# EAGLE design aqc-rev1 (EAGLE 6.1)

## Sheet 1 of 6
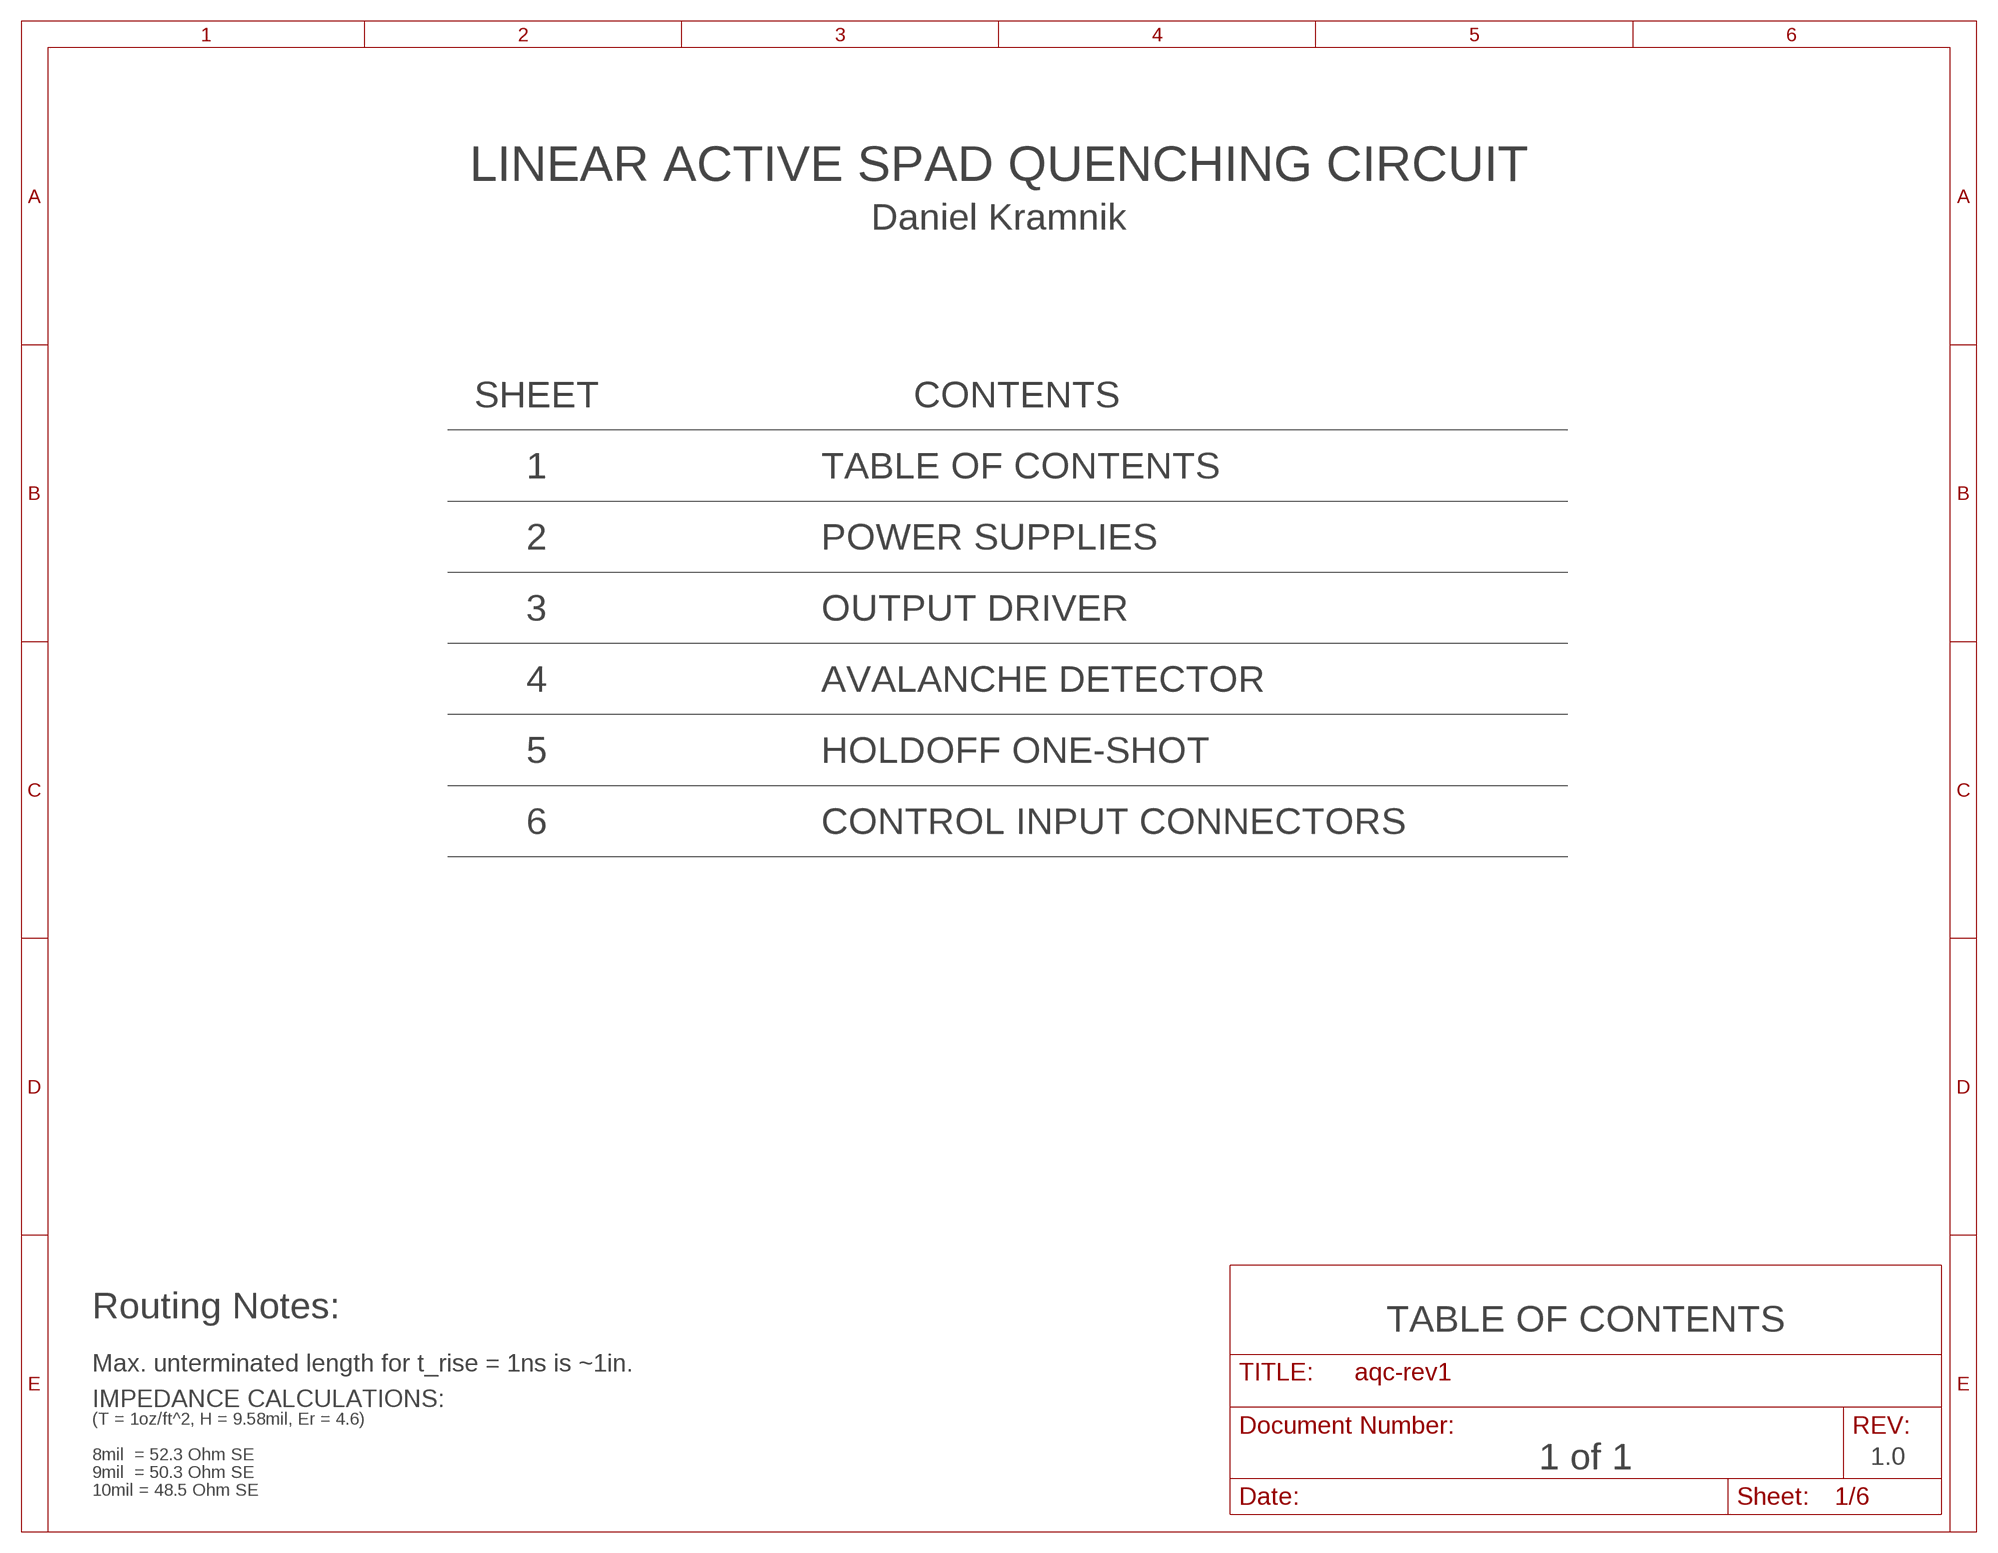
[diagram p0: schematic, sheet 1]

### Notes on the sheet
- LINEAR ACTIVE SPAD QUENCHING CIRCUIT
- Daniel Kramnik
- SHEET | CONTENTS
- 1 | TABLE OF CONTENTS
- 2 | POWER SUPPLIES
- 3 | OUTPUT DRIVER
- 4 | AVALANCHE DETECTOR
- 5 | HOLDOFF ONE-SHOT
- 6 | CONTROL INPUT CONNECTORS
- Routing Notes: | TABLE OF CONTENTS
- Max. unterminated length for t_rise = 1ns is ~1in.
- IMPEDANCE CALCULATIONS:
- (T = 1oz/ft^2, H = 9.58mil, Er = 4.6)
- 8mil  = 52.3 Ohm SE | 1 of 1 | 1.0
- 9mil  = 50.3 Ohm SE
- 10mil = 48.5 Ohm SE

## Sheet 2 of 6
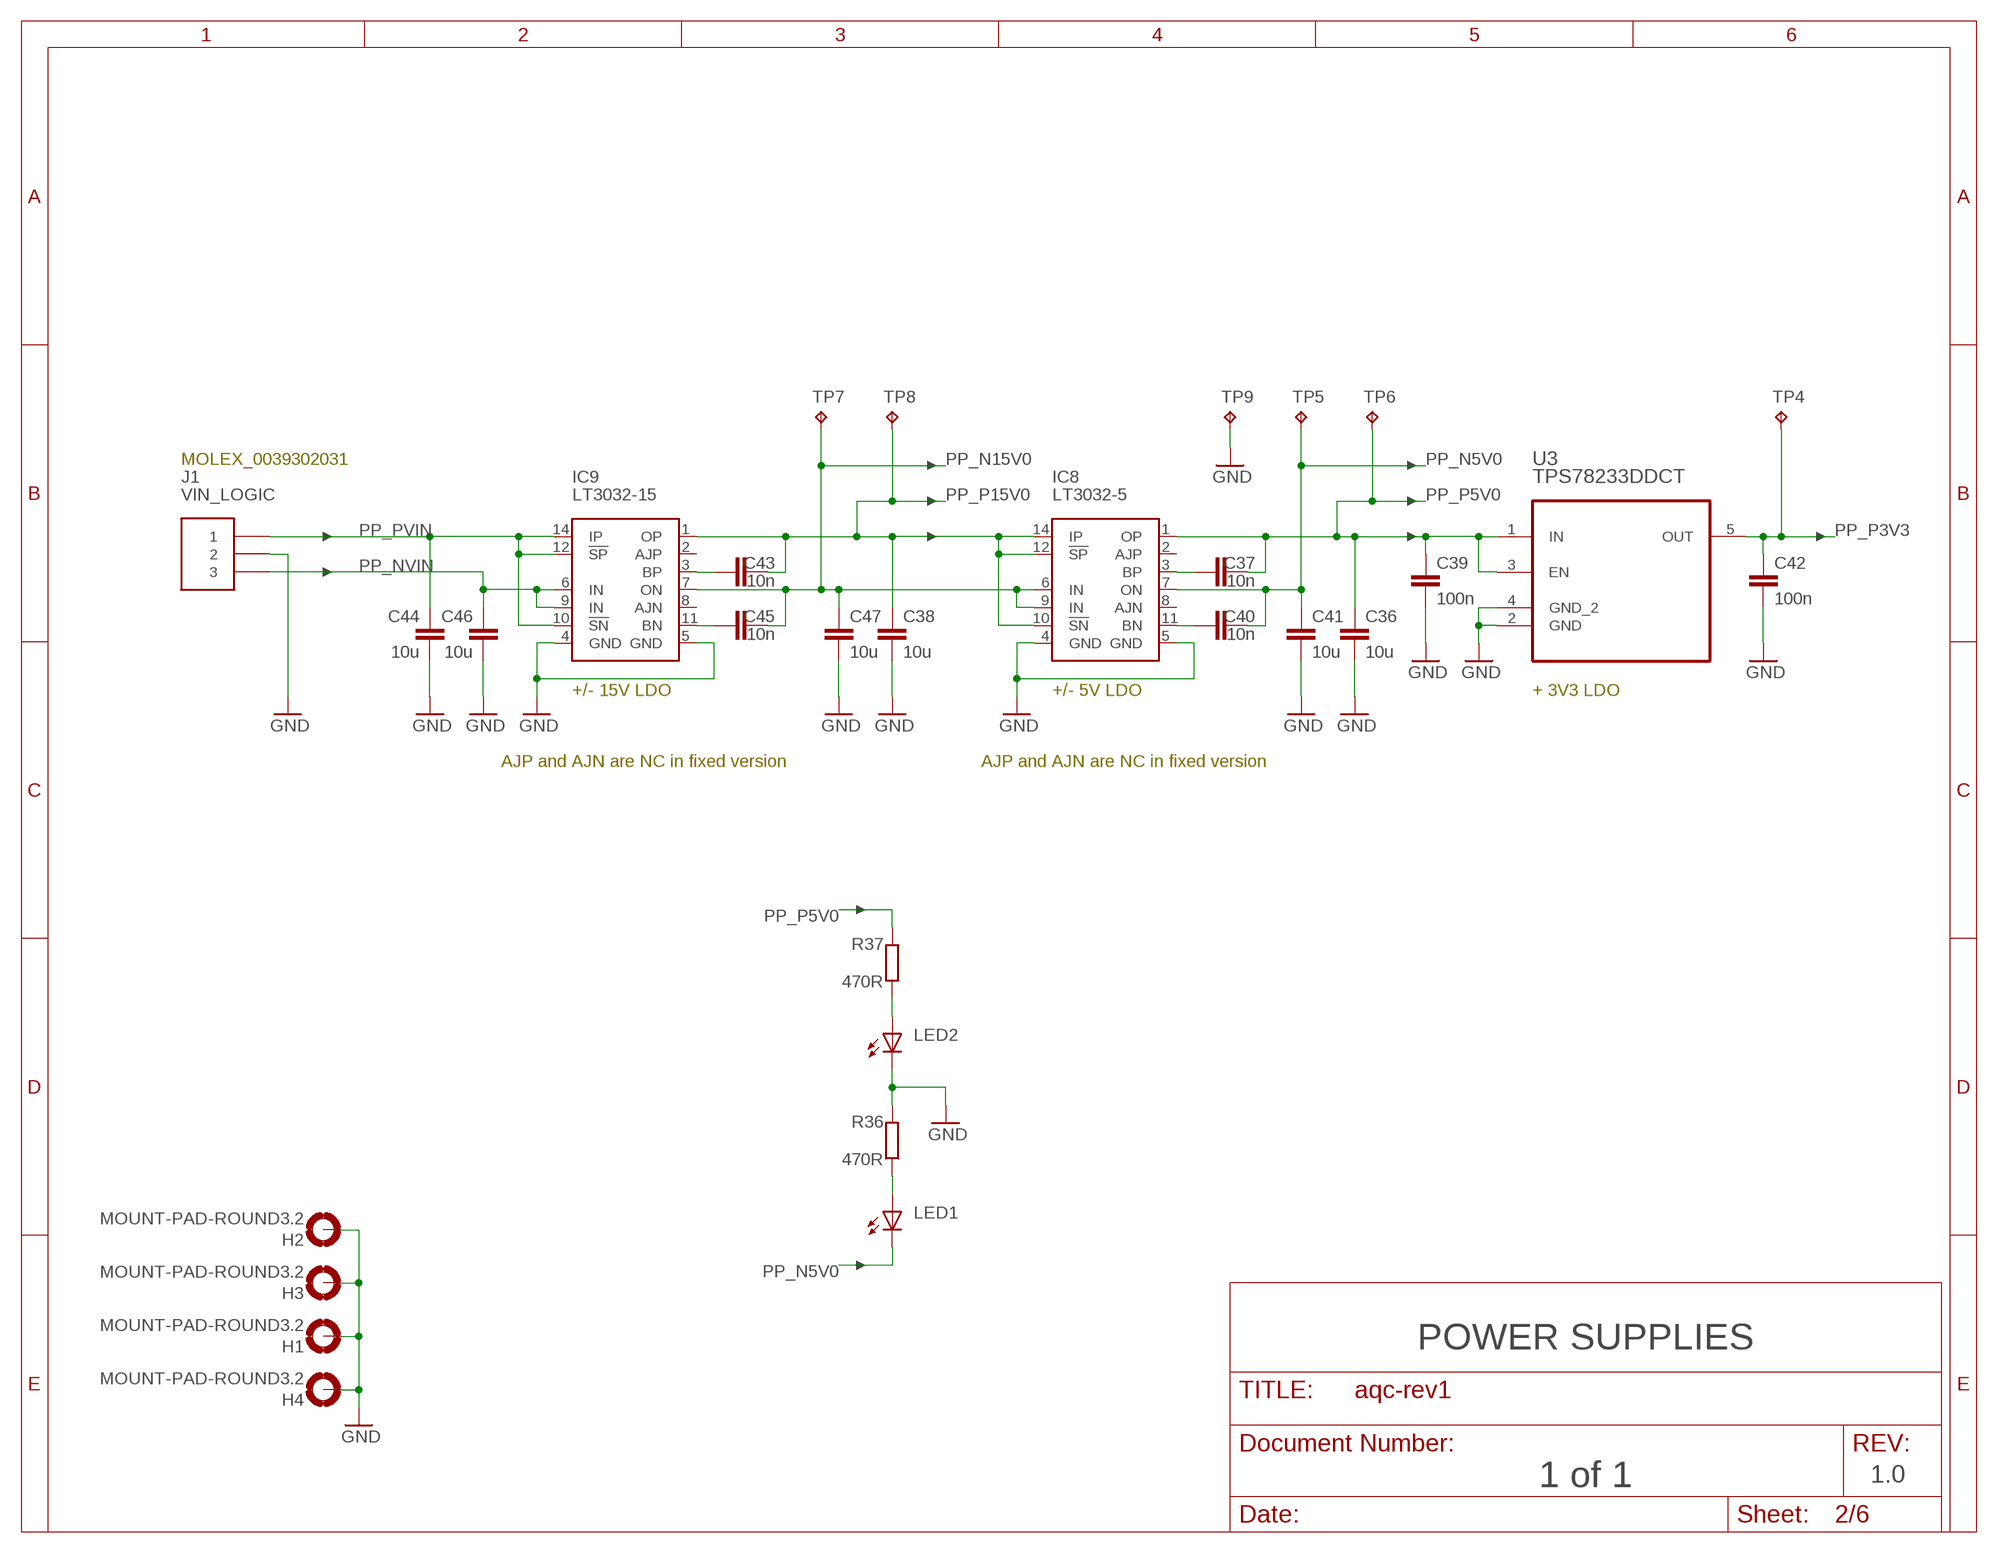
[diagram p1: schematic, sheet 2]

### Parts
C36  10u  C-EUC1206  [C1206]
C37  10n  C-EUC0603  [C0603]
C38  10u  C-EUC1206  [C1206]
C39  100n  C-EUC0603  [C0603]
C40  10n  C-EUC0603  [C0603]
C41  10u  C-EUC1206  [C1206]
C42  100n  C-EUC0603  [C0603]
C43  10n  C-EUC0603  [C0603]
C44  10u  C-EUC1206  [C1206]
C45  10n  C-EUC0603  [C0603]
C46  10u  C-EUC1206  [C1206]
C47  10u  C-EUC1206  [C1206]
H1  MOUNT-PAD-ROUND3.2  [3,2-PAD]
H2  MOUNT-PAD-ROUND3.2  [3,2-PAD]
H3  MOUNT-PAD-ROUND3.2  [3,2-PAD]
H4  MOUNT-PAD-ROUND3.2  [3,2-PAD]
IC8  LT3032-5  LT3032  [DFN14-4X3DE]
IC9  LT3032-15  LT3032  [DFN14-4X3DE]
J1  VIN_LOGIC  CONN_MOLEX_3PIN_MINI-FIT_JR  [CONN_MOLEX_3PIN_MINI-FIT_JR]
LED1  LEDCHIP-LED0805  [CHIP-LED0805]
LED2  LEDCHIP-LED0805  [CHIP-LED0805]
R36  470R  R-EU_R0805  [R0805]
R37  470R  R-EU_R0805  [R0805]
TP4  TPTP20R  [TP20R]
TP5  TPTP20R  [TP20R]
TP6  TPTP20R  [TP20R]
TP7  TPTP20R  [TP20R]
TP8  TPTP20R  [TP20R]
TP9  TPTP20R  [TP20R]
U3  TPS78233DDCT  [SOT95P280X110-5N]

### Nets
GND: C36.2 C38.2 C39.2 C41.2 C42.2 C44.2 C46.2 C47.2 H1.B3,2(MOUNT) H2.B3,2(MOUNT) H3.B3,2(MOUNT) H4.B3,2(MOUNT) IC8.4(GND) IC8.5(GND) IC9.4(GND) IC9.5(GND) J1.2 LED2.C R36.2 TP9.TP U3.2(GND) U3.4(GND_2) ; also sheet 3,4,5,6
N$8: C37.1 IC8.3(BP)
N$9: C40.1 IC8.11(BN)
N$33: C43.1 IC9.3(BP)
N$34: C45.1 IC9.11(BN)
N$39: LED1.A R36.1
N$40: LED2.A R37.1
PP_N5V0: C40.2 C41.1 IC8.7(ON) LED1.C TP5.TP ; also sheet 3,4,6
PP_N15V0: C45.2 C47.1 IC8.6(IN) IC8.9(IN) IC9.7(ON) TP7.TP
PP_NVIN: C46.1 IC9.6(IN) IC9.9(IN) J1.3
PP_P3V3: C42.1 TP4.TP U3.5(OUT) ; also sheet 4,5,6
PP_P5V0: C36.1 C37.2 C39.1 IC8.1(OP) R37.2 TP6.TP U3.1(IN) U3.3(EN) ; also sheet 3,4,6
PP_P15V0: C38.1 C43.2 IC8.10(!SN) IC8.12(!SP) IC8.14(IP) IC9.1(OP) TP8.TP ; also sheet 3
PP_PVIN: C44.1 IC9.10(!SN) IC9.12(!SP) IC9.14(IP) J1.1
Unconnected: IC8.2(AJP) IC8.8(AJN) IC9.2(AJP) IC9.8(AJN)

### Notes on the sheet
- MOLEX_0039302031
- +/- 15V LDO | +/- 5V LDO | + 3V3 LDO
- AJP and AJN are NC in fixed version | AJP and AJN are NC in fixed version
- POWER SUPPLIES
- 1 of 1 | 1.0

## Sheet 3 of 6
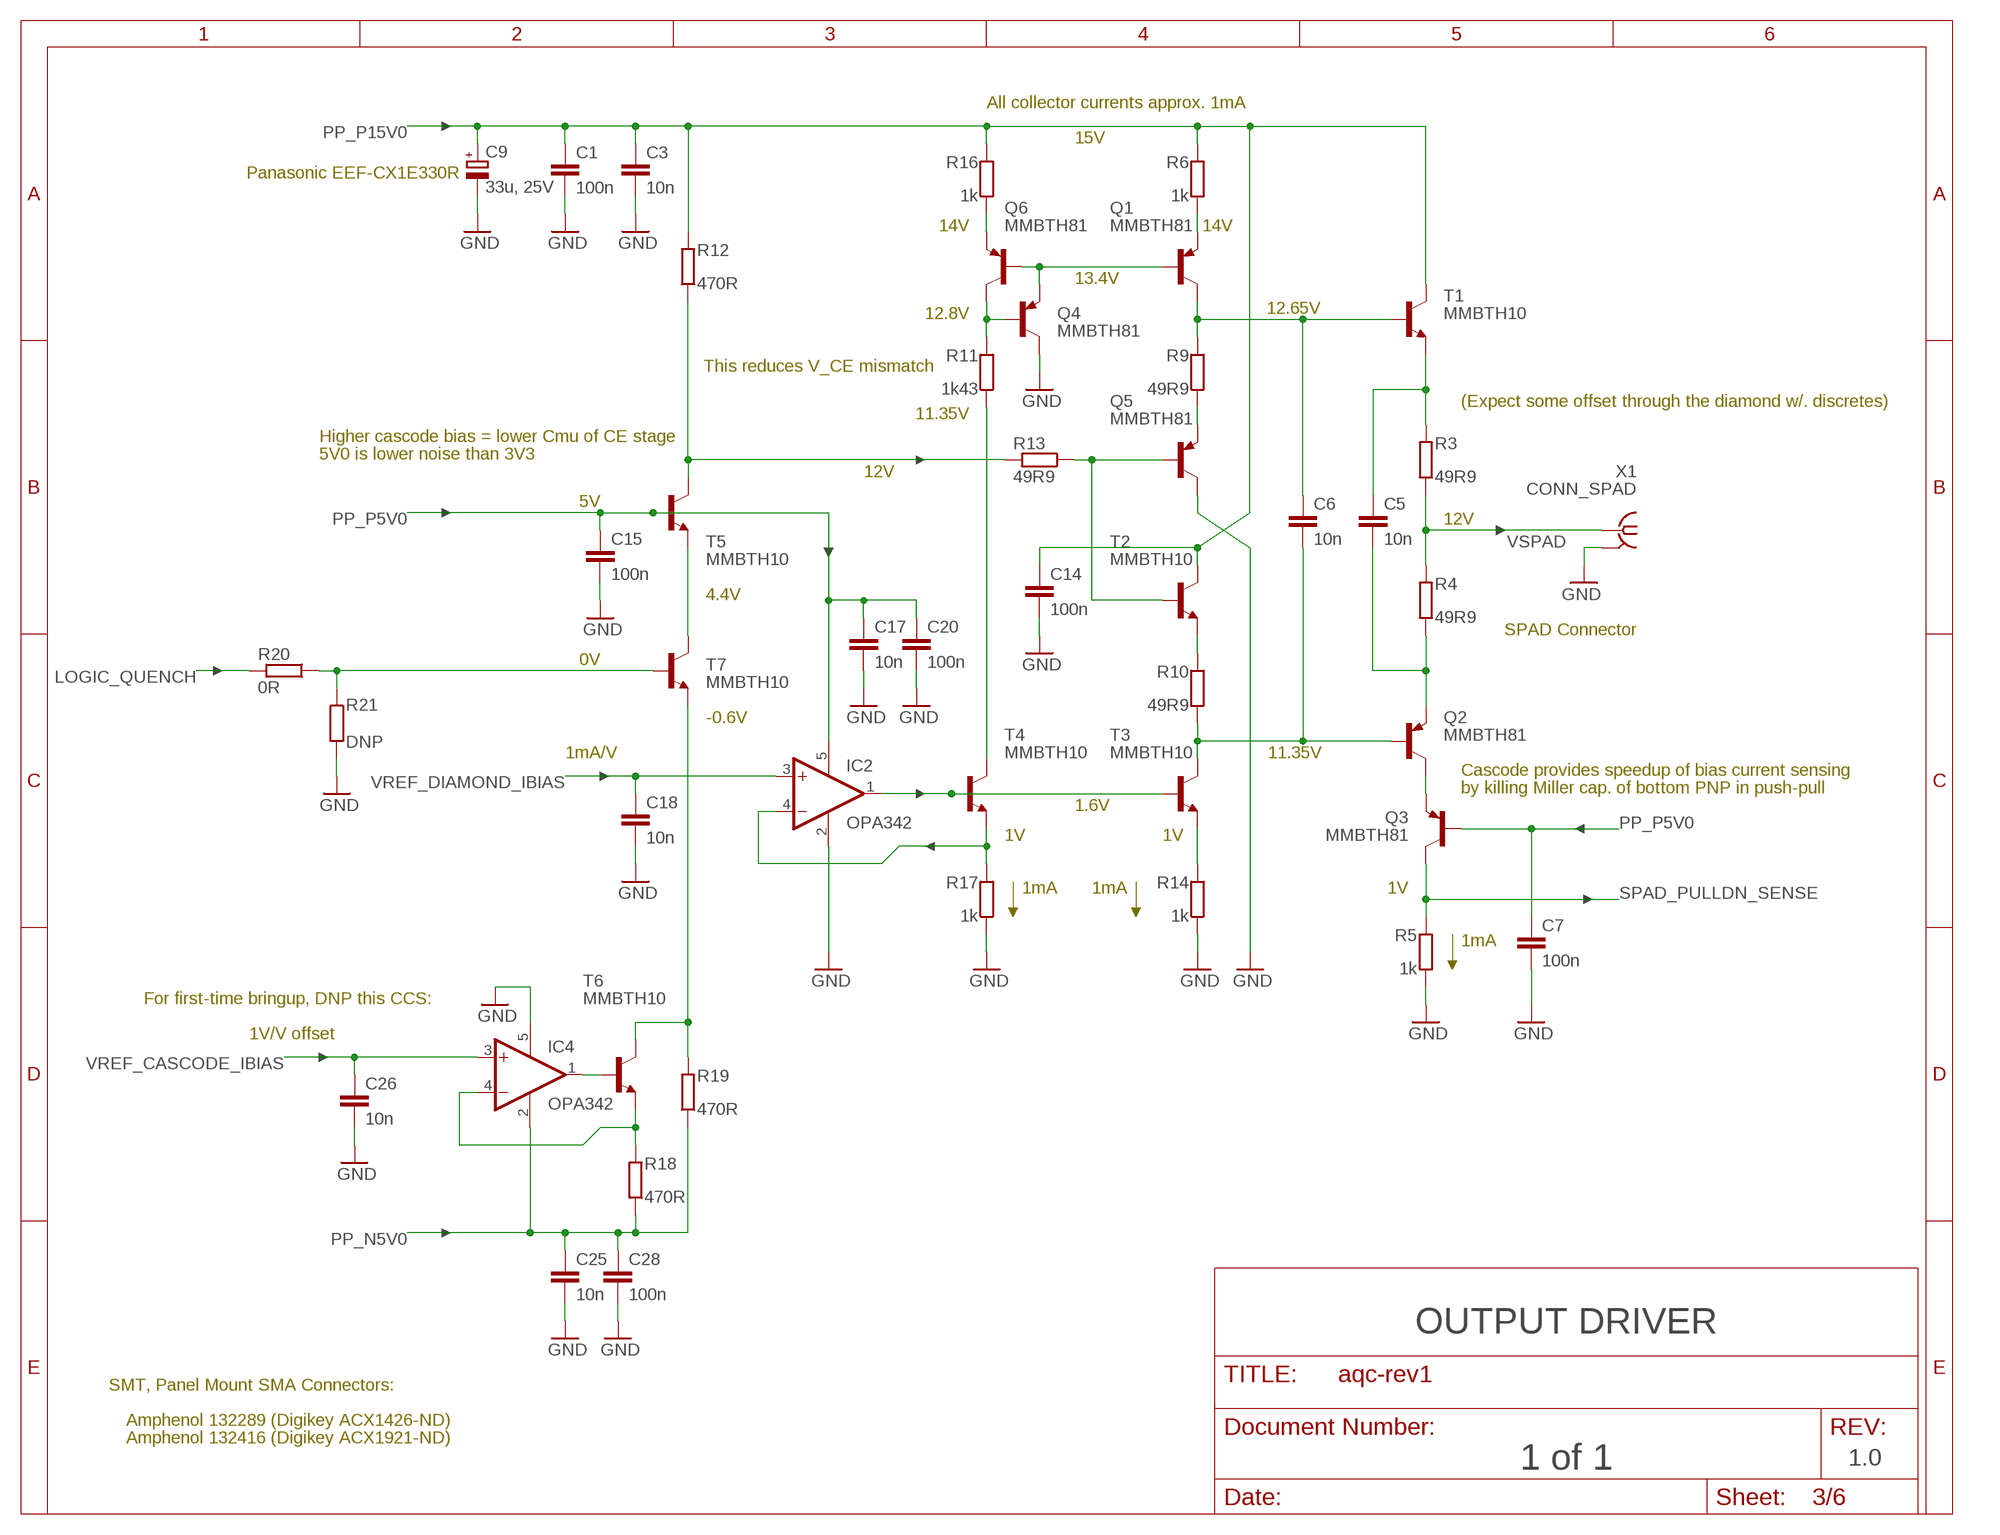
[diagram p2: schematic, sheet 3]

### Parts
C1  100n  C-EUC0603  [C0603]
C3  10n  C-EUC0603  [C0603]
C5  10n  C-EUC0603  [C0603]
C6  10n  C-EUC0603  [C0603]
C7  100n  C-EUC0603  [C0603]
C9  33u, 25V  CPOL-EUCT7343  [CT7343]
C14  100n  C-EUC0603  [C0603]
C15  100n  C-EUC0603  [C0603]
C17  10n  C-EUC0402  [C0402]
C18  10n  C-EUC0402  [C0402]
C20  100n  C-EUC0402  [C0402]
C25  10n  C-EUC0402  [C0402]
C26  10n  C-EUC0402  [C0402]
C28  100n  C-EUC0402  [C0402]
IC2  OPA342  OPA333DBV  [SOT23-5]
IC4  OPA342  OPA333DBV  [SOT23-5]
Q1  MMBTH81  MMBTH81LT1SMD  [SOT23-BEC]
Q2  MMBTH81  MMBTH81LT1SMD  [SOT23-BEC]
Q3  MMBTH81  MMBTH81LT1SMD  [SOT23-BEC]
Q4  MMBTH81  MMBTH81LT1SMD  [SOT23-BEC]
Q5  MMBTH81  MMBTH81LT1SMD  [SOT23-BEC]
Q6  MMBTH81  MMBTH81LT1SMD  [SOT23-BEC]
R3  49R9  R-EU_R0603  [R0603]
R4  49R9  R-EU_R0603  [R0603]
R5  1k  R-EU_R0603  [R0603]
R6  1k  R-EU_R0603  [R0603]
R9  49R9  R-EU_R0603  [R0603]
R10  49R9  R-EU_R0603  [R0603]
R11  1k43  R-EU_R0603  [R0603]
R12  470R  R-EU_R0603  [R0603]
R13  49R9  R-EU_R0603  [R0603]
R14  1k  R-EU_R0603  [R0603]
R16  1k  R-EU_R0603  [R0603]
R17  1k  R-EU_R0603  [R0603]
R18  470R  R-EU_R0603  [R0603]
R19  470R  R-EU_R0603  [R0603]
R20  0R  R-EU_R0603  [R0603]
R21  DNP  R-EU_R0603  [R0603]
T1  MMBTH10  MMBTH10LT1-NPN-SOT23-BEC  [SOT23-BEC]
T2  MMBTH10  MMBTH10LT1-NPN-SOT23-BEC  [SOT23-BEC]
T3  MMBTH10  MMBTH10LT1-NPN-SOT23-BEC  [SOT23-BEC]
T4  MMBTH10  MMBTH10LT1-NPN-SOT23-BEC  [SOT23-BEC]
T5  MMBTH10  MMBTH10LT1-NPN-SOT23-BEC  [SOT23-BEC]
T6  MMBTH10  MMBTH10LT1-NPN-SOT23-BEC  [SOT23-BEC]
T7  MMBTH10  MMBTH10LT1-NPN-SOT23-BEC  [SOT23-BEC]
X1  CONN_SPAD  SMA-142-0711-871/876  [J502-ND-142-0711-871/876]

### Nets
GND: C1.2 C3.2 C7.2 C9.- C14.2 C15.2 C17.2 C18.2 C20.2 C25.2 C26.2 C28.2 IC2.2(V-) IC4.5(V+) Q4.C Q5.C R5.1 R14.1 R17.1 R21.2 X1.G@1(GND) ; also sheet 2,4,5,6
LOGIC_QUENCH: R20.2 ; also sheet 5
LOGIC_QUENCH_ATTEN: R20.1 R21.1 T7.B
N$5: C5.1 R3.2 T1.E
N$10: Q2.C Q3.E
N$11: Q5.E R9.1
N$12: C6.1 Q1.C R9.2 T1.B
N$13: R10.2 T2.E
N$14: C5.2 Q2.E R4.1
N$15: T5.E T7.C
N$16: IC2.1(OUT) T3.B T4.B
N$18: Q4.B Q6.C R11.2
N$19: C6.2 Q2.B R10.1 T3.C
N$20: R14.2 T3.E
N$21: Q5.B R13.1 T2.B
N$22: R12.1 R13.2 T5.C
N$23: IC2.4(-IN) R17.2 T4.E
N$24: R19.2 T6.C T7.E
N$26: Q1.E R6.1
N$27: R11.1 T4.C
N$29: Q6.E R16.1
N$30: IC4.1(OUT) T6.B
N$31: Q1.B Q4.E Q6.B
N$35: IC4.4(-IN) R18.2 T6.E
PP_N5V0: C25.1 C28.1 IC4.2(V-) R18.1 R19.1 ; also sheet 2,4,6
PP_P5V0: C7.1 C15.1 C17.1 C20.1 IC2.5(V+) Q3.B T5.B ; also sheet 2,4,6
PP_P15V0: C1.1 C3.1 C9.+ C14.1 R6.2 R12.2 R16.2 T1.C T2.C ; also sheet 2
SPAD_PULLDN_SENSE: Q3.C R5.2 ; also sheet 4
VREF_CASCODE_IBIAS: C26.1 IC4.3(+IN) ; also sheet 6
VREF_DIAMOND_IBIAS: C18.1 IC2.3(+IN) ; also sheet 6
VSPAD: R3.1 R4.2 X1.1

### Notes on the sheet
- All collector currents approx. 1mA
- 15V
- Panasonic EEF-CX1E330R
- 14V | 14V
- 13.4V
- 12.65V
- 12.8V
- This reduces V_CE mismatch
- 11.35V | (Expect some offset through the diamond w/. discretes)
- Higher cascode bias = lower Cmu of CE stage
- 5V0 is lower noise than 3V3
- 12V
- 5V
- 12V
- 4.4V
- SPAD Connector
- 0V
- -0.6V
- 1mA/V | 11.35V
- Cascode provides speedup of bias current sensing
- by killing Miller cap. of bottom PNP in push-pull
- 1.6V
- 1V | 1V
- 1mA | 1mA | 1V
- 1mA
- For first-time bringup, DNP this CCS:
- 1V/V offset
- OUTPUT DRIVER
- SMT, Panel Mount SMA Connectors:
- Amphenol 132289 (Digikey ACX1426-ND)
- Amphenol 132416 (Digikey ACX1921-ND)
- 1 of 1 | 1.0

## Sheet 4 of 6
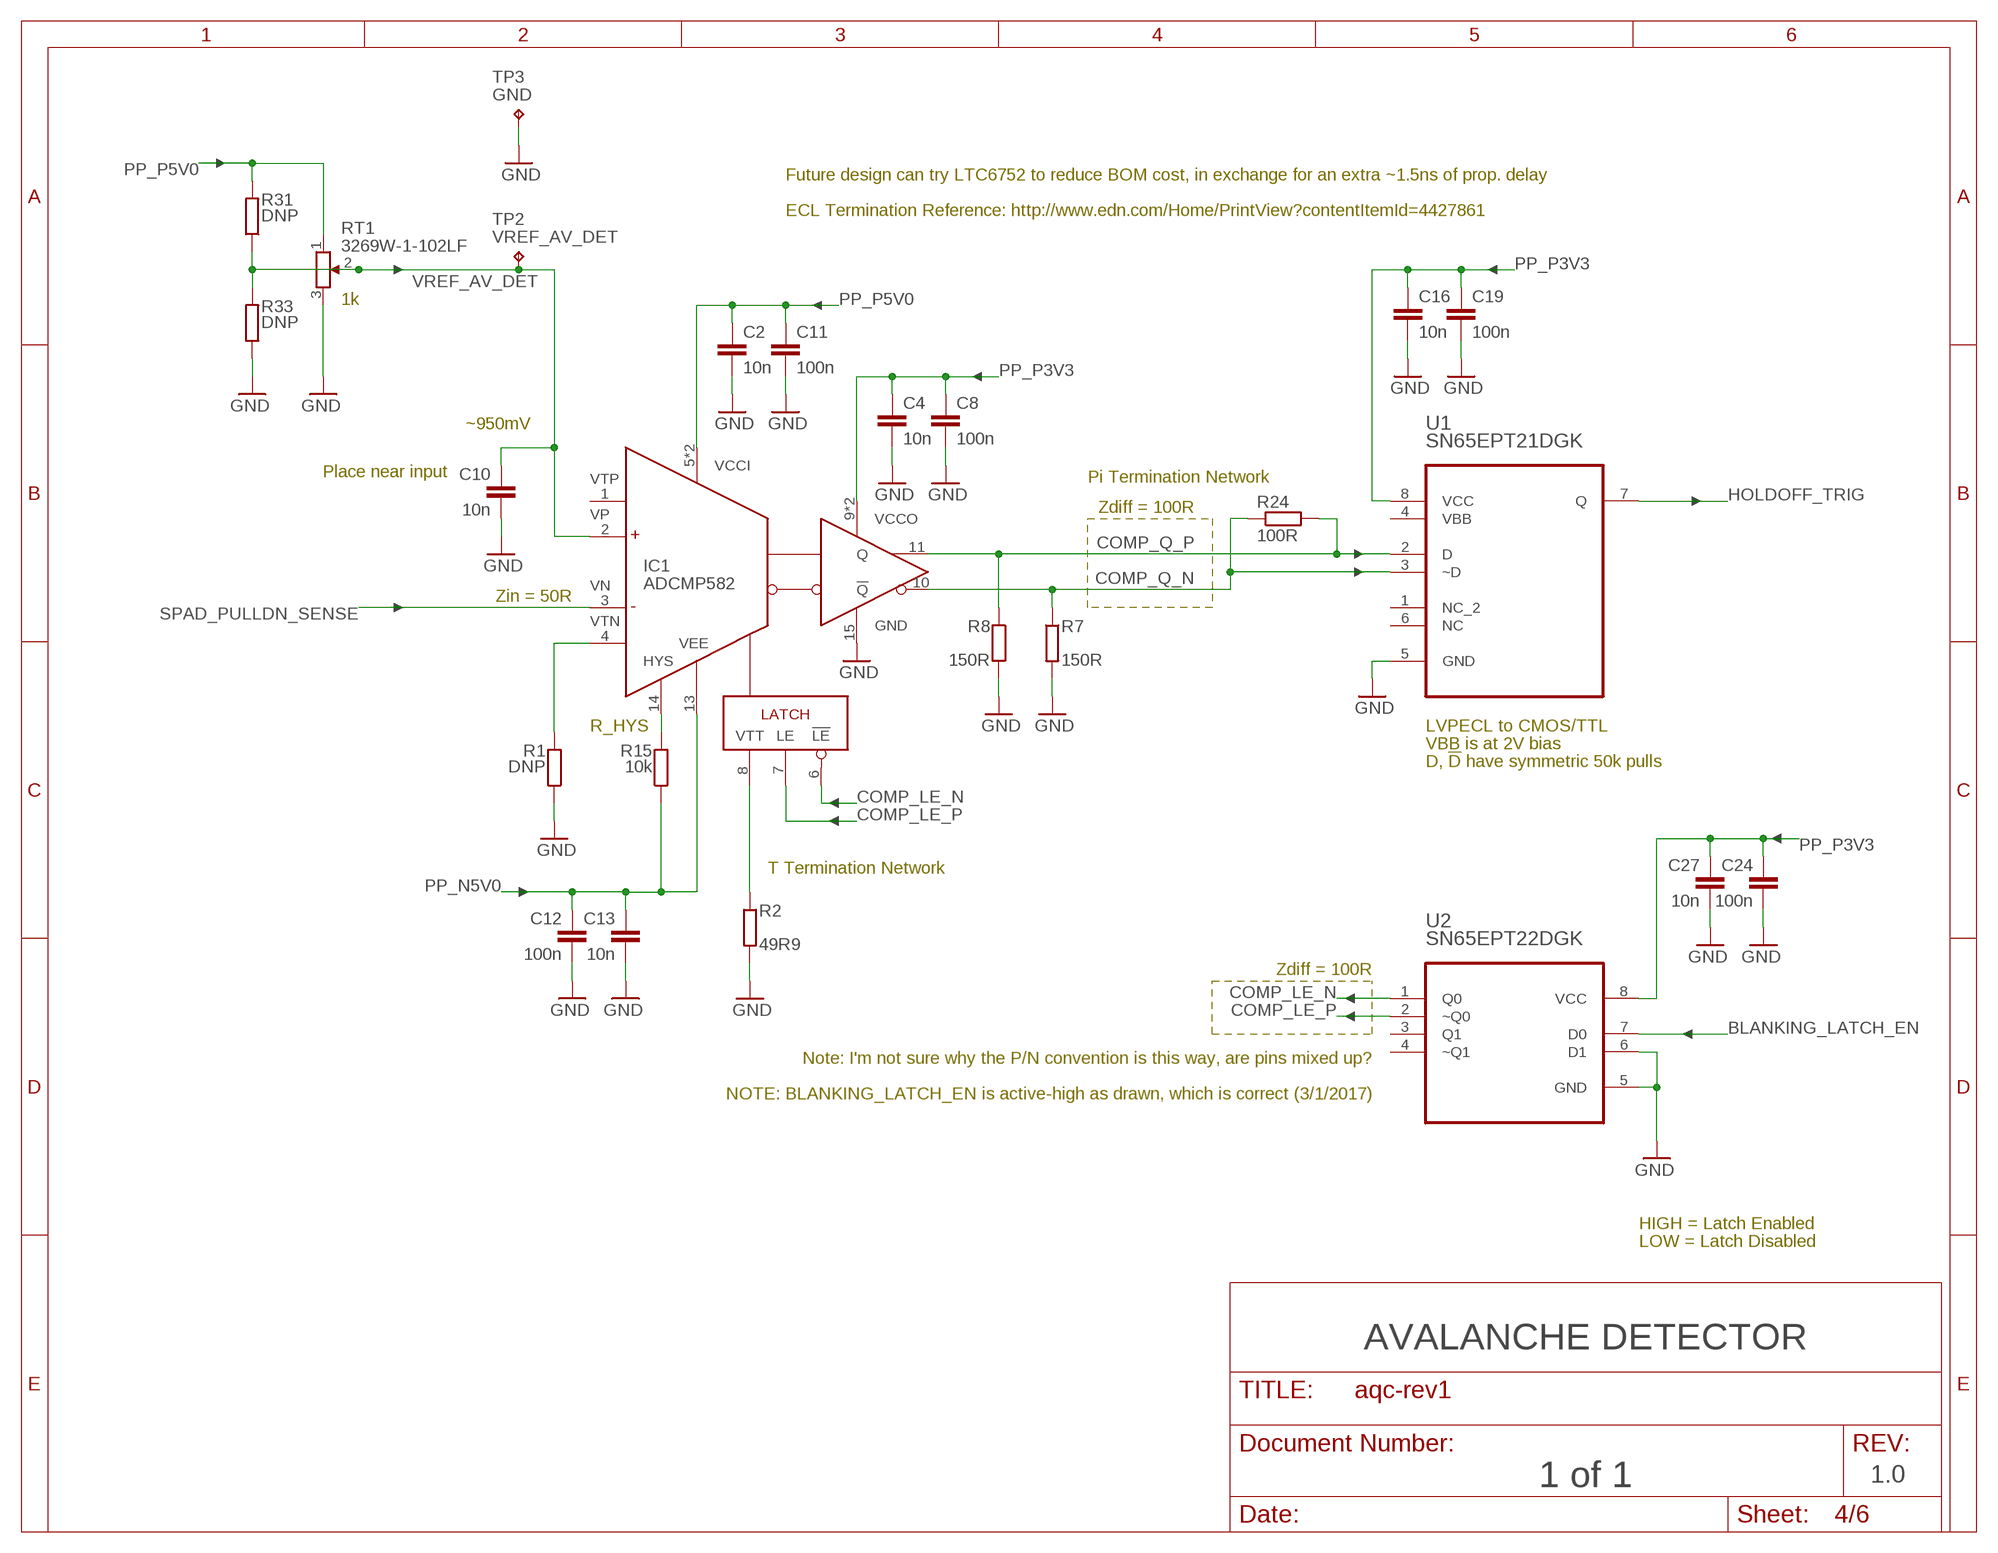
[diagram p3: schematic, sheet 4]

### Parts
C2  10n  C-EUC0402  [C0402]
C4  10n  C-EUC0402  [C0402]
C8  100n  C-EUC0402  [C0402]
C10  10n  C-EUC0603  [C0603]
C11  100n  C-EUC0402  [C0402]
C12  100n  C-EUC0402  [C0402]
C13  10n  C-EUC0402  [C0402]
C16  10n  C-EUC0402  [C0402]
C19  100n  C-EUC0402  [C0402]
C24  100n  C-EUC0402  [C0402]
C27  10n  C-EUC0402  [C0402]
IC1  ADCMP582  [QFN50P300X300X80-16N]
R1  DNP  R-EU_R0603  [R0603]
R2  49R9  R-EU_R0603  [R0603]
R7  150R  R-EU_R0402  [R0402]
R8  150R  R-EU_R0402  [R0402]
R15  10k  R-EU_R0603  [R0603]
R24  100R  R-EU_R0402  [R0402]
R31  DNP  R-EU_R0603  [R0603]
R33  DNP  R-EU_R0603  [R0603]
RT1  3269W-1-102LF  BOURNS_3269WX  [3269W]
TP2  VREF_AV_DET  KEYSTONE_5000  [KEYSTONE_5000_MINIATURE]
TP3  GND  KEYSTONE_5000  [KEYSTONE_5000_MINIATURE]
U1  SN65EPT21DGK  [SOP65P490X110-8N]
U2  SN65EPT22DGK  [SOP65P490X110-8N]

### Nets
BLANKING_LATCH_EN: U2.7(D0) ; also sheet 5
COMP_LE_N [100OHM_DIFF]: IC1.6(!LE) U2.1(Q0)
COMP_LE_P [100OHM_DIFF]: IC1.7(LE) U2.2(~Q0)
COMP_Q_N [100OHM_DIFF]: IC1.10(!Q) R7.1 R24.1 U1.3(~D)
COMP_Q_P [100OHM_DIFF]: IC1.11(Q) R8.1 R24.2 U1.2(D)
GND: C2.2 C4.2 C8.2 C10.2 C11.2 C12.2 C13.2 C16.2 C19.2 C24.2 C27.2 IC1.15(GND) R1.1 R2.2 R7.2 R8.2 R33.1 RT1.3 TP3.P$1 U1.5(GND) U2.5(GND) U2.6(D1) ; also sheet 2,3,5,6
HOLDOFF_TRIG: U1.7(Q) ; also sheet 5
N$3: IC1.4(VTN) R1.2
N$4: IC1.14(HYS) R15.2
N$6: IC1.8(VTT) R2.1
PP_N5V0: C12.1 C13.1 IC1.13(VEE) R15.1 ; also sheet 2,3,6
PP_P3V3: C4.1 C8.1 C16.1 C19.1 C24.1 C27.1 IC1.9(VCCO) IC1.12(VCCO) U1.8(VCC) U2.8(VCC) ; also sheet 2,5,6
PP_P5V0: C2.1 C11.1 IC1.5(VCCI) IC1.16(VCCI) R31.2 RT1.1 ; also sheet 2,3,6
SPAD_PULLDN_SENSE: IC1.3(VN) ; also sheet 3
VREF_AV_DET: C10.1 IC1.2(VP) R31.1 R33.2 RT1.2 TP2.P$1
Unconnected: IC1.1(VTP) U1.1(NC_2) U1.6(NC) U2.3(Q1) U2.4(~Q1)

### Notes on the sheet
- Future design can try LTC6752 to reduce BOM cost, in exchange for an extra ~1.5ns of prop. delay
- ECL Termination Reference: http://www.edn.com/Home/PrintView?contentItemId=4427861
- 1k
- ~950mV
- Place near input
- Pi Termination Network
- Zdiff = 100R
- Zin = 50R
- R_HYS | LVPECL to CMOS/TTL
- VBB is at 2V bias
- D, !D! have symmetric 50k pulls
- T Termination Network
- Zdiff = 100R
- Note: I'm not sure why the P/N convention is this way, are pins mixed up?
- NOTE: BLANKING_LATCH_EN is active-high as drawn, which is correct (3/1/2017)
- HIGH = Latch Enabled
- LOW = Latch Disabled
- AVALANCHE DETECTOR
- 1 of 1 | 1.0

## Sheet 5 of 6
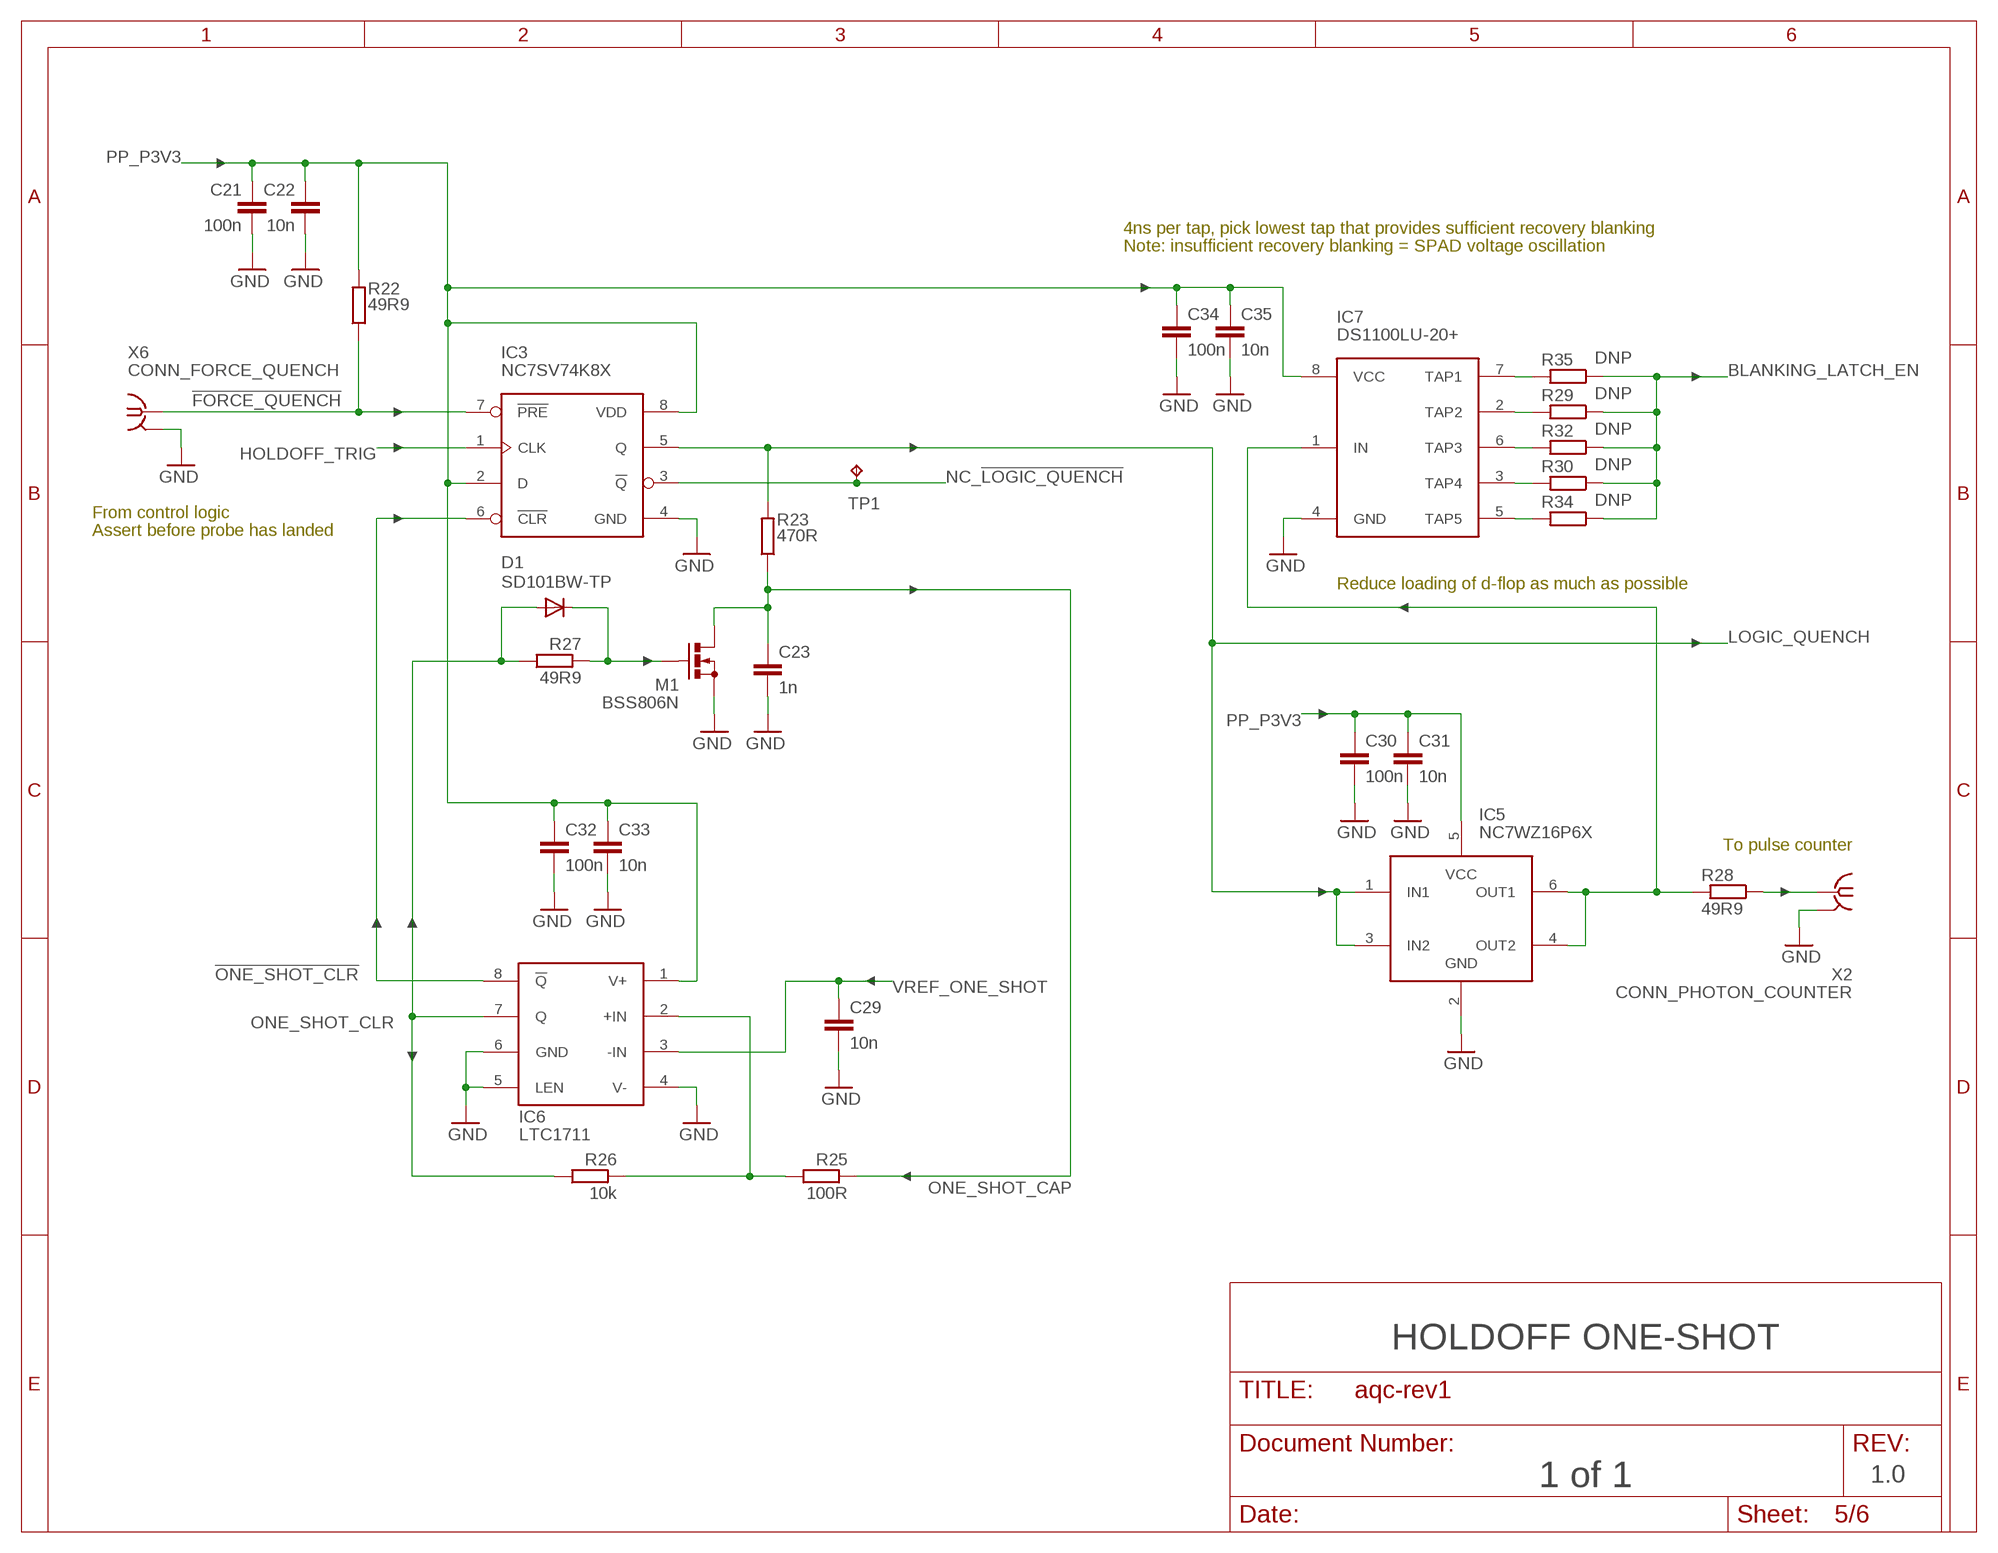
[diagram p4: schematic, sheet 5]

### Parts
C21  100n  C-EUC0402  [C0402]
C22  10n  C-EUC0402  [C0402]
C23  1n  C-EUC0603  [C0603]
C29  10n  C-EUC0402  [C0402]
C30  100n  C-EUC0402  [C0402]
C31  10n  C-EUC0402  [C0402]
C32  100n  C-EUC0402  [C0402]
C33  10n  C-EUC0402  [C0402]
C34  100n  C-EUC0402  [C0402]
C35  10n  C-EUC0402  [C0402]
D1  SD101BW-TP  DIODE-SOD123  [SOD123]
IC3  NC7SV74K8X  [US8_3.1MM_JDEC_MO-187]
IC5  NC7WZ16P6X  [SC70-6L]
IC6  LTC1711  [MSOP8]
IC7  DS1100LU-20+  DS1100L  [MSOP8]
M1  BSS806N  [SOT23R_INFINEON]
R22  49R9  R-EU_R0603  [R0603]
R23  470R  R-EU_R0603  [R0603]
R25  100R  R-EU_R0603  [R0603]
R26  10k  R-EU_R0603  [R0603]
R27  49R9  R-EU_R0603  [R0603]
R28  49R9  R-EU_R0603  [R0603]
R29  DNP  R-EU_R0603  [R0603]
R30  DNP  R-EU_R0603  [R0603]
R32  DNP  R-EU_R0603  [R0603]
R34  DNP  R-EU_R0603  [R0603]
R35  DNP  R-EU_R0603  [R0603]
TP1  TPTP08R  [TP08R]
X2  CONN_PHOTON_COUNTER  SMA-142-0711-871/876  [J502-ND-142-0711-871/876]
X6  CONN_FORCE_QUENCH  SMA-142-0711-871/876  [J502-ND-142-0711-871/876]

### Nets
!FORCE_QUENCH: IC3.7(!PRE) R22.1 X6.1
!ONE_SHOT_CLR: IC3.6(!CLR) IC6.8(!Q)
BLANKING_LATCH_EN: R29.1 R30.1 R32.1 R34.1 R35.1 ; also sheet 4
GND: C21.2 C22.2 C23.2 C29.2 C30.2 C31.2 C32.2 C33.2 C34.2 C35.2 IC3.4(GND) IC5.2(GND) IC6.4(V-) IC6.5(LEN) IC6.6(GND) IC7.4(GND) M1.2(S) X2.G@1(GND) X6.G@1(GND) ; also sheet 2,3,4,6
HOLDOFF_TRIG: IC3.1(CLK) ; also sheet 4
LOGIC_QUENCH: IC3.5(Q) IC5.1(IN1) IC5.3(IN2) R23.2 ; also sheet 3
N$2: R28.1 X2.1
N$25: IC6.2(+IN) R25.1 R26.2
N$36: D1.C M1.1(G) R27.2
N$37: IC5.4(OUT2) IC5.6(OUT1) IC7.1(IN) R28.2
NC_!LOGIC_QUENCH: IC3.3(!Q) TP1.TP
ONE_SHOT_CAP: C23.1 M1.3(D) R23.1 R25.2
ONE_SHOT_CLR: D1.A IC6.7(Q) R26.1 R27.1
PP_P3V3: C21.1 C22.1 C30.1 C31.1 C32.1 C33.1 C34.1 C35.1 IC3.2(D) IC3.8(VDD) IC5.5(VCC) IC6.1(V+) IC7.8(VCC) R22.2 ; also sheet 2,4,6
TAP1: IC7.7(TAP1) R35.2
TAP2: IC7.2(TAP2) R29.2
TAP3: IC7.6(TAP3) R32.2
TAP4: IC7.3(TAP4) R30.2
TAP5: IC7.5(TAP5) R34.2
VREF_ONE_SHOT: C29.1 IC6.3(-IN) ; also sheet 6

### Notes on the sheet
- 4ns per tap, pick lowest tap that provides sufficient recovery blanking
- Note: insufficient recovery blanking = SPAD voltage oscillation
- From control logic
- Assert before probe has landed
- Reduce loading of d-flop as much as possible
- To pulse counter
- HOLDOFF ONE-SHOT
- 1 of 1 | 1.0

## Sheet 6 of 6
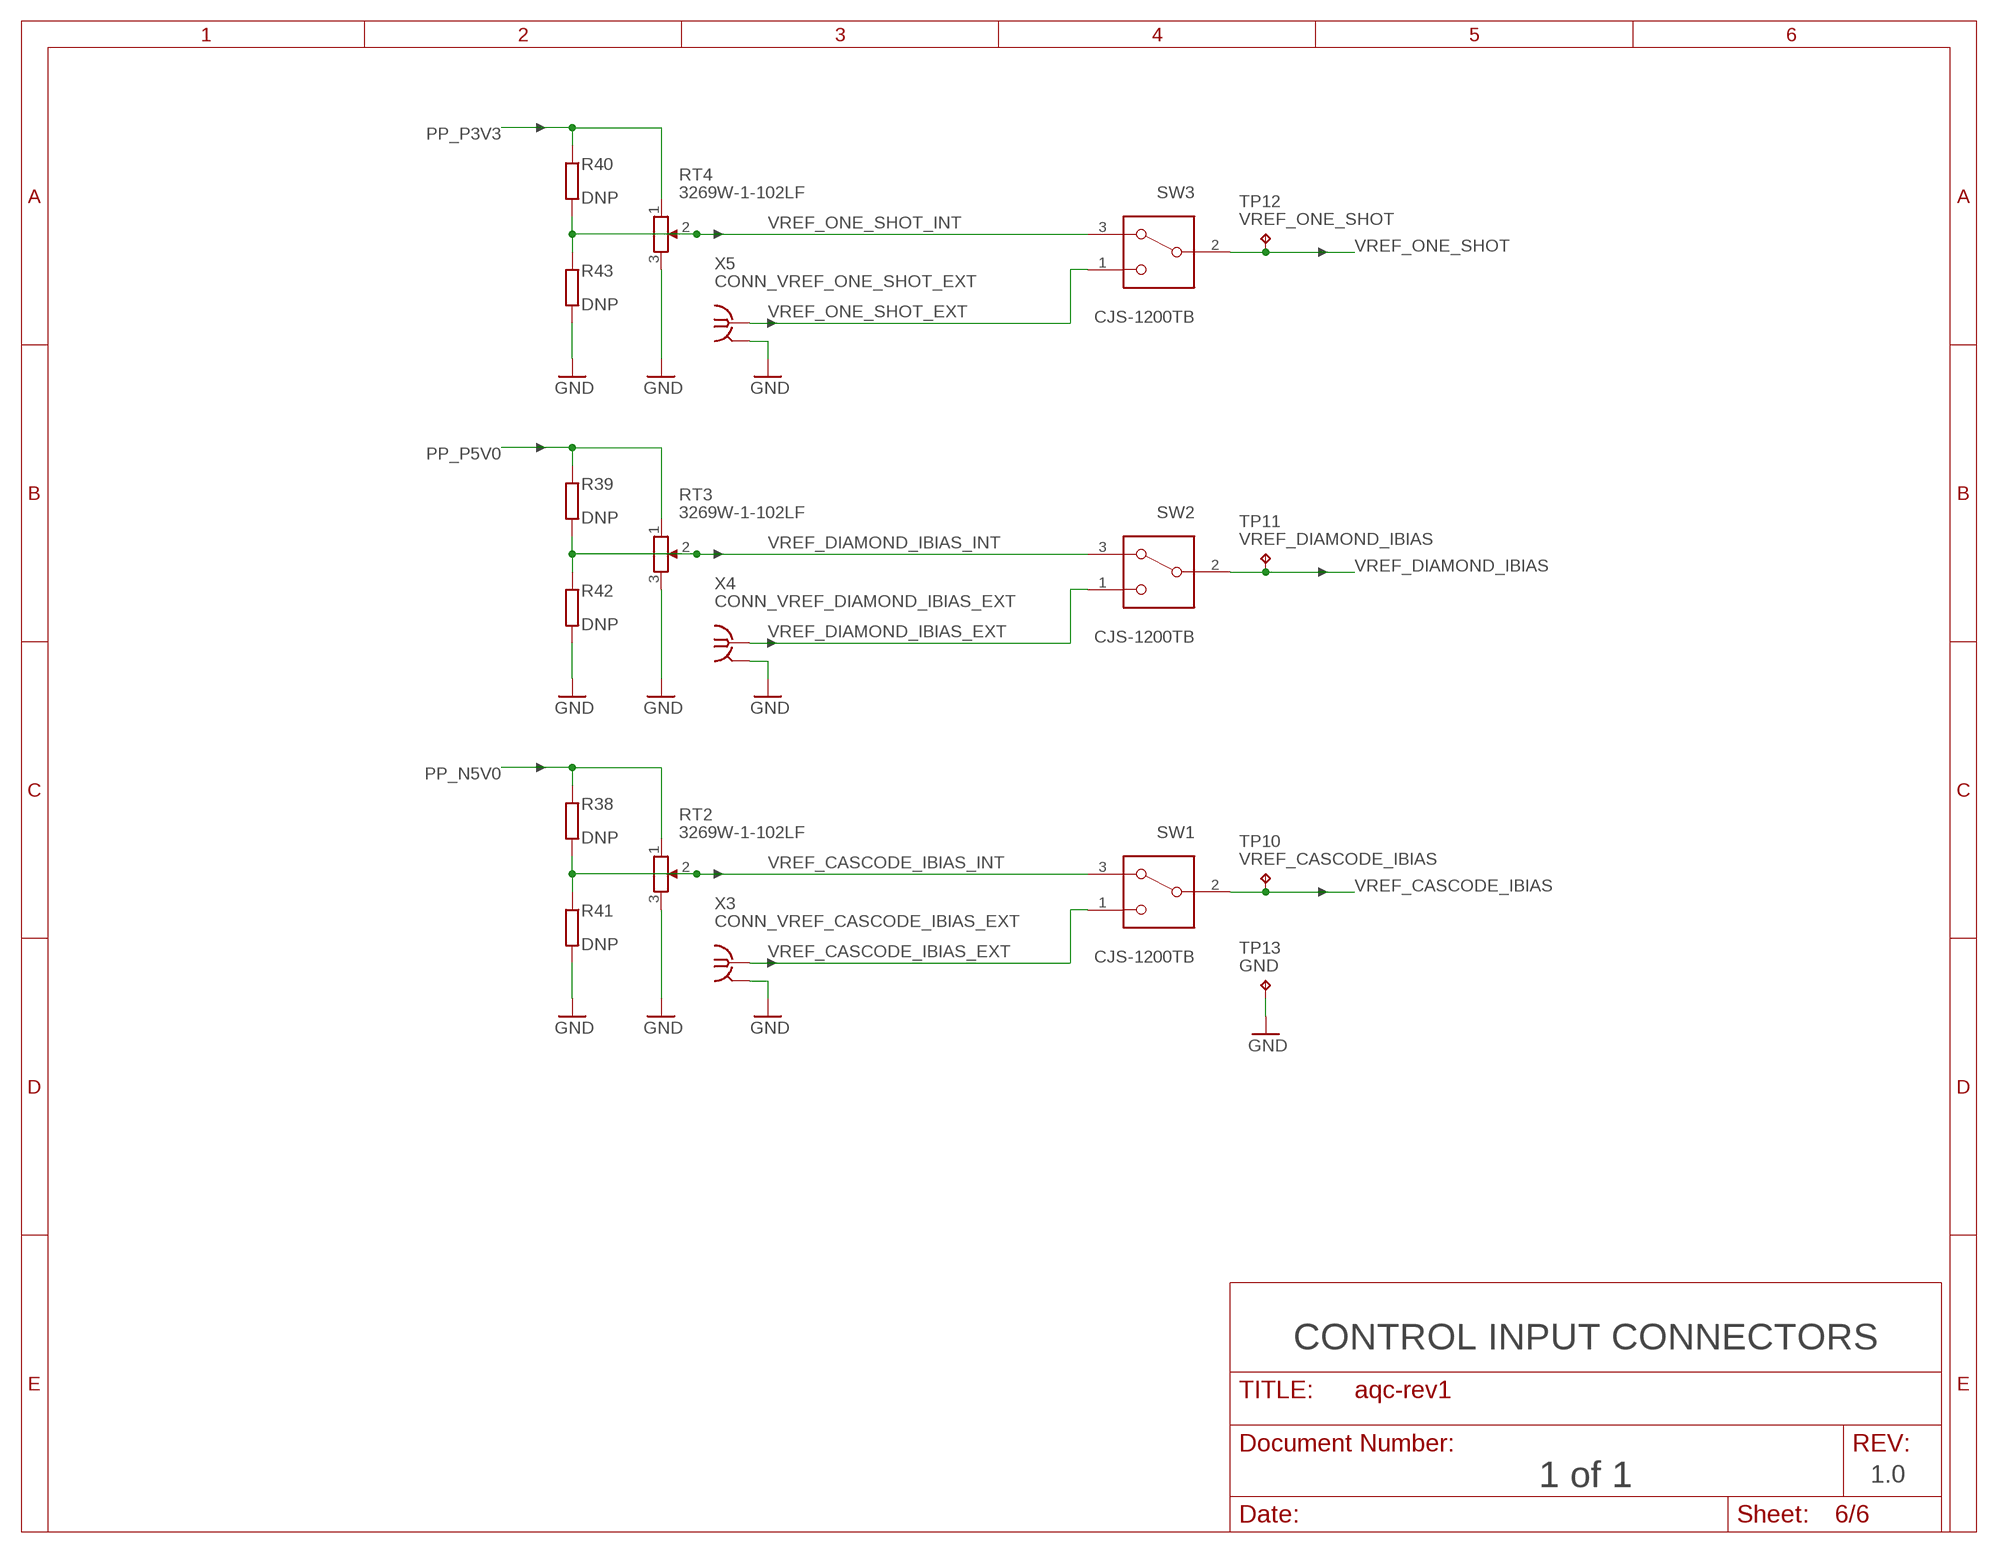
[diagram p5: schematic, sheet 6]

### Parts
R38  DNP  R-EU_R0603  [R0603]
R39  DNP  R-EU_R0603  [R0603]
R40  DNP  R-EU_R0603  [R0603]
R41  DNP  R-EU_R0603  [R0603]
R42  DNP  R-EU_R0603  [R0603]
R43  DNP  R-EU_R0603  [R0603]
RT2  3269W-1-102LF  BOURNS_3269WX  [3269W]
RT3  3269W-1-102LF  BOURNS_3269WX  [3269W]
RT4  3269W-1-102LF  BOURNS_3269WX  [3269W]
SW1  CJS-1200TB  [CJS-1200TB]
SW2  CJS-1200TB  [CJS-1200TB]
SW3  CJS-1200TB  [CJS-1200TB]
TP10  VREF_CASCODE_IBIAS  KEYSTONE_5000  [KEYSTONE_5000_MINIATURE]
TP11  VREF_DIAMOND_IBIAS  KEYSTONE_5000  [KEYSTONE_5000_MINIATURE]
TP12  VREF_ONE_SHOT  KEYSTONE_5000  [KEYSTONE_5000_MINIATURE]
TP13  GND  KEYSTONE_5000  [KEYSTONE_5000_MINIATURE]
X3  CONN_VREF_CASCODE_IBIAS_EXT  SMA-142-0711-871/876  [J502-ND-142-0711-871/876]
X4  CONN_VREF_DIAMOND_IBIAS_EXT  SMA-142-0711-871/876  [J502-ND-142-0711-871/876]
X5  CONN_VREF_ONE_SHOT_EXT  SMA-142-0711-871/876  [J502-ND-142-0711-871/876]

### Nets
GND: R41.2 R42.2 R43.2 RT2.3 RT3.3 RT4.3 TP13.P$1 X3.G@1(GND) X4.G@1(GND) X5.G@1(GND) ; also sheet 2,3,4,5
PP_N5V0: R38.1 RT2.1 ; also sheet 2,3,4
PP_P3V3: R40.1 RT4.1 ; also sheet 2,4,5
PP_P5V0: R39.1 RT3.1 ; also sheet 2,3,4
VREF_CASCODE_IBIAS: SW1.2(COM) TP10.P$1 ; also sheet 3
VREF_CASCODE_IBIAS_EXT: SW1.1(NO) X3.1
VREF_CASCODE_IBIAS_INT: R38.2 R41.1 RT2.2 SW1.3(NC)
VREF_DIAMOND_IBIAS: SW2.2(COM) TP11.P$1 ; also sheet 3
VREF_DIAMOND_IBIAS_EXT: SW2.1(NO) X4.1
VREF_DIAMOND_IBIAS_INT: R39.2 R42.1 RT3.2 SW2.3(NC)
VREF_ONE_SHOT: SW3.2(COM) TP12.P$1 ; also sheet 5
VREF_ONE_SHOT_EXT: SW3.1(NO) X5.1
VREF_ONE_SHOT_INT: R40.2 R43.1 RT4.2 SW3.3(NC)

### Notes on the sheet
- CONTROL INPUT CONNECTORS
- 1 of 1 | 1.0

## Power pins joined to a net without a drawn wire
GND: X1.G@2(GND) X1.G@3(GND) X1.G@4(GND) X2.G@2(GND) X2.G@3(GND) X2.G@4(GND) X3.G@2(GND) X3.G@3(GND) X3.G@4(GND) X4.G@2(GND) X4.G@3(GND) X4.G@4(GND) X5.G@2(GND) X5.G@3(GND) X5.G@4(GND) X6.G@2(GND) X6.G@3(GND) X6.G@4(GND)
VBB: U1.4(VBB)

## Library data of the parts
C1-C8 C10-C47 = rcl:C-EU: CAPACITOR, European symbol
C9 = rcl:CPOL-EU: POLARIZED CAPACITOR, European symbol
D1 = diode:DIODE-: DIODE
H1-H4 = holes:MOUNT-PAD-ROUND: MOUNTING PAD, round
IC1 = meng:ADCMP582: Ultrafast SiGe Voltage Comparator w/. PECL Outputs http://www.analog.com/media/en/technical-documentation/data-sheets/ADCMP580_581_582.pdf
IC2 IC4 = meng:OPA333: 1.8V, microPOWER CMOS OPERATIONAL AMPLIFIERS Zerø-Drift Series Source: Texas Instruments (Burr-Brown) .. U11 opa333 Operational Amp.pdf
IC3 = meng:NC7SV74K8X
IC5 = meng:NC7WZ16P6X
IC6 = meng:LTC1711
IC7 = meng:DS1100L
IC8 IC9 = meng:LT3032: LT3032 dual postive/negative LDO linear regulator; VALUE: LT3032
J1 = Kramnik's Library:CONN_MOLEX_3PIN_MINI-FIT_JR; VALUE: MOLEX_0039302031
LED1 LED2 = led:LED: LED OSRAM: - CHIPLED LG R971, LG N971, LY N971, LG Q971, LY Q971, LO R971, LY R971 LH N974, LH R974 LS Q976, LO Q976, LY Q976 LO Q996 - Hyper CHIPLED LW Q18S LB Q993, LB Q99A, LB R99A - SideLED LS A670, LO A670, LY A670, LG A670, LP A670 LB A673, LV A673, LT A673, LW A673 LH A674 LY A675 LS A676, LA A676, LO A676, LY A676, LW A676 LS A679, LY A679, LG A679 - Hyper Micro SIDELED® LS Y876, LA Y876, LO Y876, LY Y876 LT Y87S - SmartLED LW L88C, LW L88S LB L89C, LB L89S, LG L890 LS L89K, LO L89K, LY L89K LS L896, LA L896, LO L896, LY L896 - TOPLED LS T670, LO T670, LY T670, LG T670, LP T670 LSG T670, LSP T670, LSY T670, LOP T670, LYG T670 LG T671, LOG T671, LSG T671 LB T673, LV T673, LT T673, LW T673 LH T674 LS T676, LA T676, LO T676, LY T676, LB T676, LH T676, LSB T676, LW T676 LB T67C, LV T67C, LT T67C, LS T67K, LO T67K, LY T67K, LW E67C LS E67B, LA E67B, LO E67B, LY E67B, LB E67C, LV E67C, LT E67C LW T67C LS T679, LY T679, LG T679 LS T770, LO T770, LY T770, LG T770, LP T770 LB T773, LV T773, LT T773, LW T773 LH T774 LS E675, LA E675, LY E675, LS T675 LS T776, LA T776, LO T776, LY T776, LB T776 LHGB T686 LT T68C, LB T68C - Hyper Mini TOPLED® LB M676 - Mini TOPLED Santana® LG M470 LS M47K, LO M47K, LY M47K Source: http://www.osram.convergy.de LUXEON: - LUMILED® LXK2-PW12-R00, LXK2-PW12-S00, LXK2-PW14-U00, LXK2-PW14-V00 LXK2-PM12-R00, LXK2-PM12-S00, LXK2-PM14-U00 LXK2-PE12-Q00, LXK2-PE12-R00, LXK2-PE12-S00, LXK2-PE14-T00, LXK2-PE14-U00 LXK2-PB12-K00, LXK2-PB12-L00, LXK2-PB12-M00, LXK2-PB14-N00, LXK2-PB14-P00, LXK2-PB14-Q00 LXK2-PR12-L00, LXK2-PR12-M00, LXK2-PR14-Q00, LXK2-PR14-R00 LXK2-PD12-Q00, LXK2-PD12-R00, LXK2-PD12-S00 LXK2-PH12-R00, LXK2-PH12-S00 LXK2-PL12-P00, LXK2-PL12-Q00, LXK2-PL12-R00 Source: www.luxeon.com KINGBRIGHT: KA-3528ASYC Source: www.kingbright.com
M1 = meng:BSS806N
Q1-Q6 = transistor-pnp:MMBTH81*: PNP Transistror
R1-R35 R38-R43 = rcl:R-EU_: RESISTOR, European symbol
R36 R37 = resistor:R-EU_: RESISTOR, European symbol
RT1-RT4 = meng:BOURNS_3269WX
SW1-SW3 = meng:CJS-1200TB
T1-T7 = transistor:*-NPN-: NPN Transistror BF959 corrected 2008.03.06
TP1 TP4-TP9 = testpad:TP: Test pad
TP2 TP3 TP10-TP13 = Kramnik's Library:KEYSTONE_5000
U1 = Texas Instruments_By_element14_Batch_1:SN65EPT21DGK: 3.3-V Differential PECL/LVDS to TTL Translator; MPN: SN65EPT21DGK; OC_FARNELL: -; OC_NEWARK: 74R6512; PACKAGE: MSOP-8; SUPPLIER: Texas Instruments
U2 = Texas Instruments_By_element14_Batch_1:SN65EPT22DGK: Dual LVTTL/LVCMOS to Differential LVPECL Buffer; MPN: SN65EPT22DGK; OC_FARNELL: -; OC_NEWARK: 45P8158; PACKAGE: MSOP-8; SUPPLIER: Texas Instruments
U3 = Texas Instruments_By_element14_Batch_1 (2):TPS78233DDCT: Low-Dropout Linear Regulator; MPN: TPS78233DDCT; OC_FARNELL: 1710835; OC_NEWARK: 45P8307; PACKAGE: TSOT-23-5; SUPPLIER: Texas Instruments
X1-X6 = con-coax:SMA-: SMA 50 Ohm End Launch Jack Receptacle - Round Contact Johnson Components Source: www.johnsoncomponents.com .. J502-ND.pdf; MF: JOHNSON COMPONENTS; MPN: 142-0711-871; OC_FARNELL: unknown; OC_NEWARK: 01C1639

## Net classes
1 100OHM_DIFF: width 0.254 mm, clearance 0.254 mm

## Board
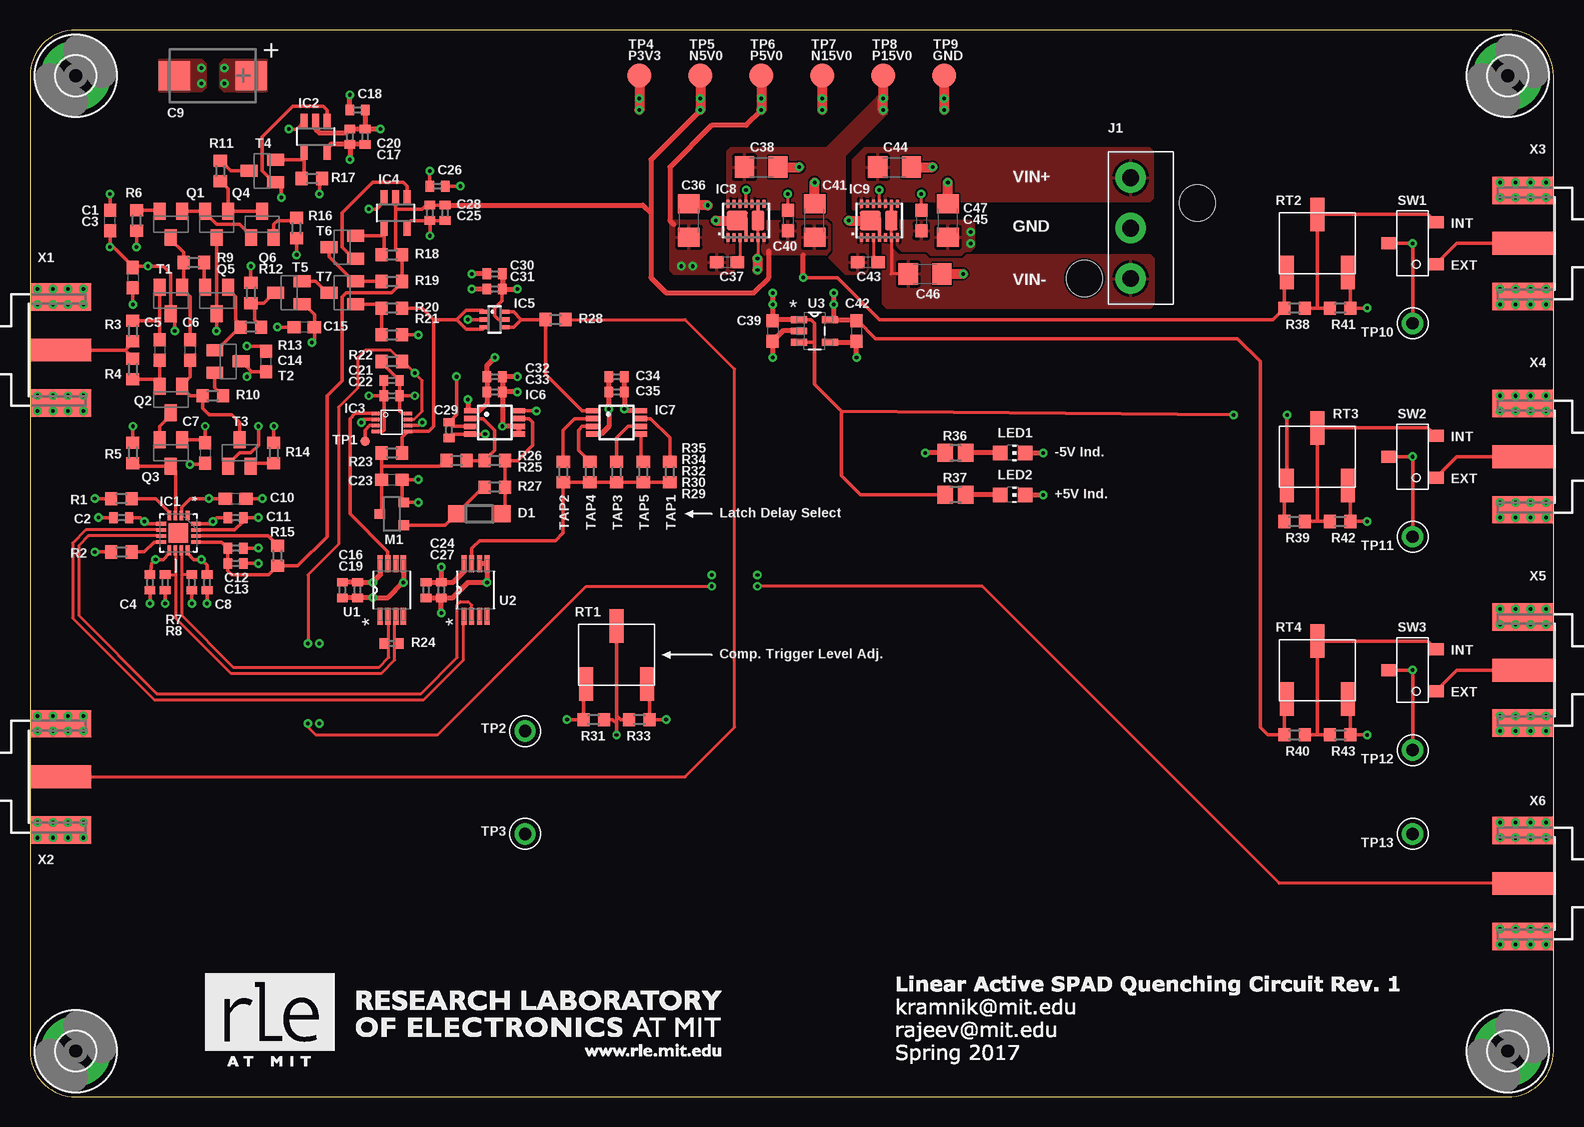
[diagram p6: board, top side]
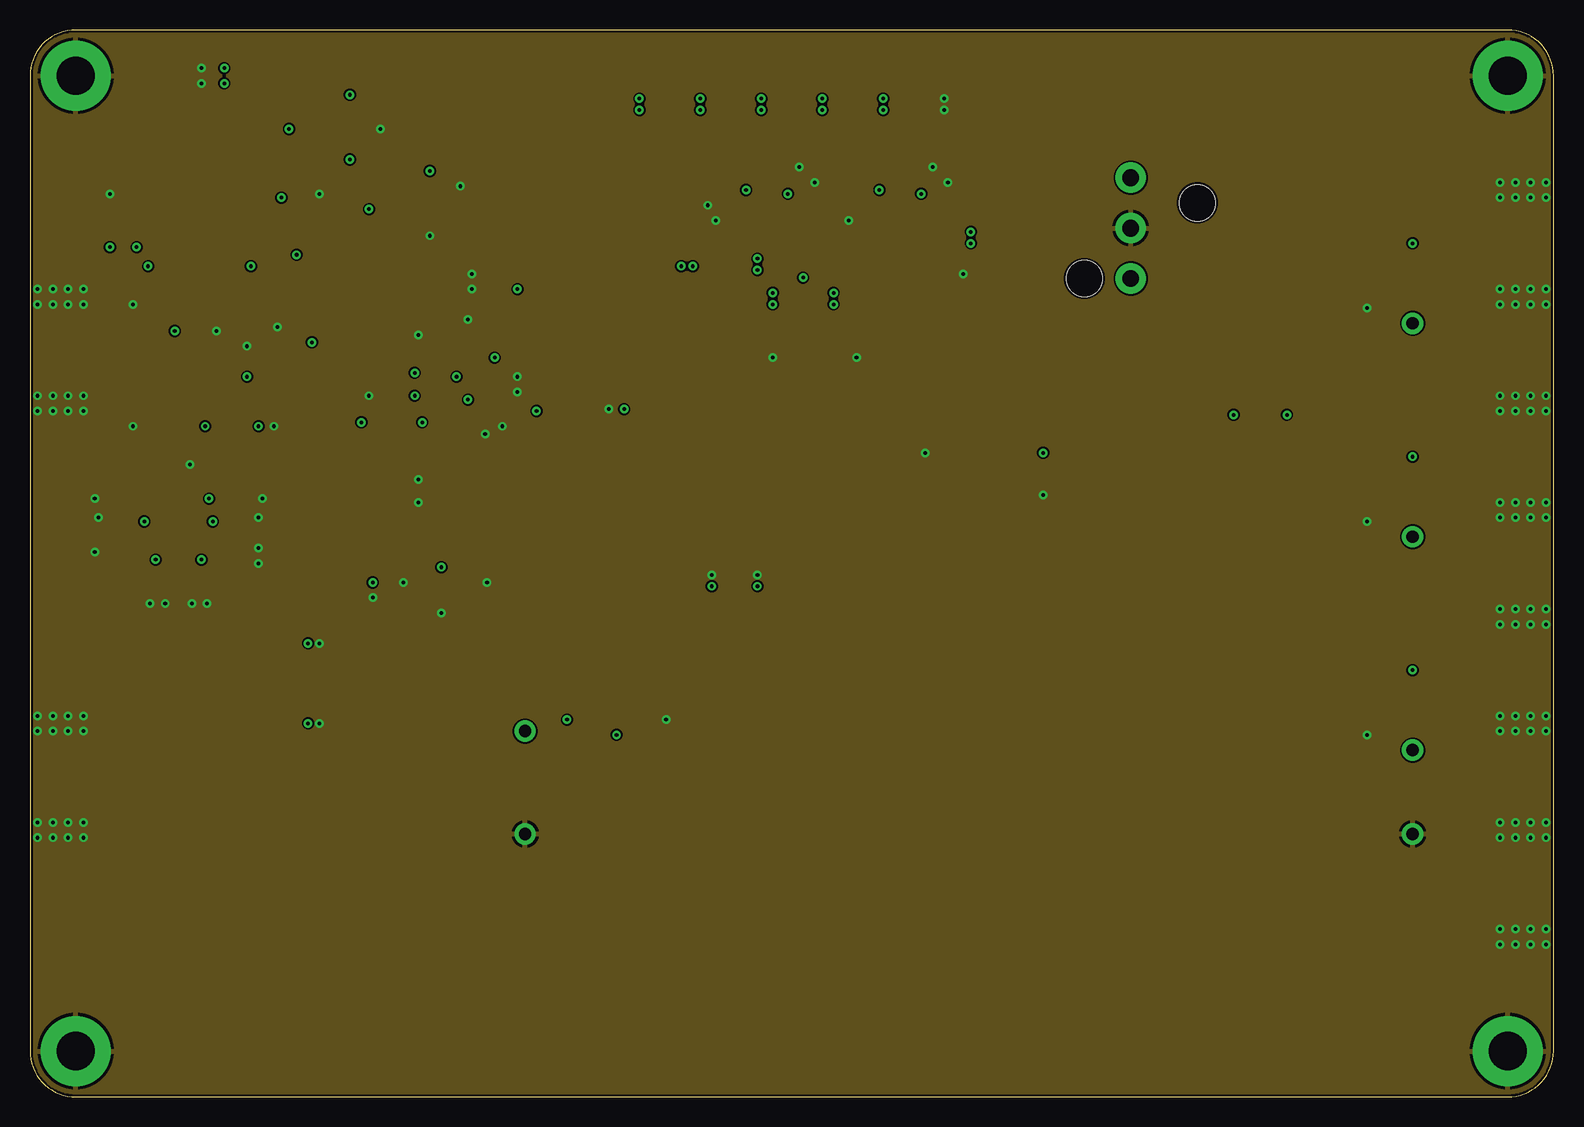
[diagram p7: board, inner layer Route2]
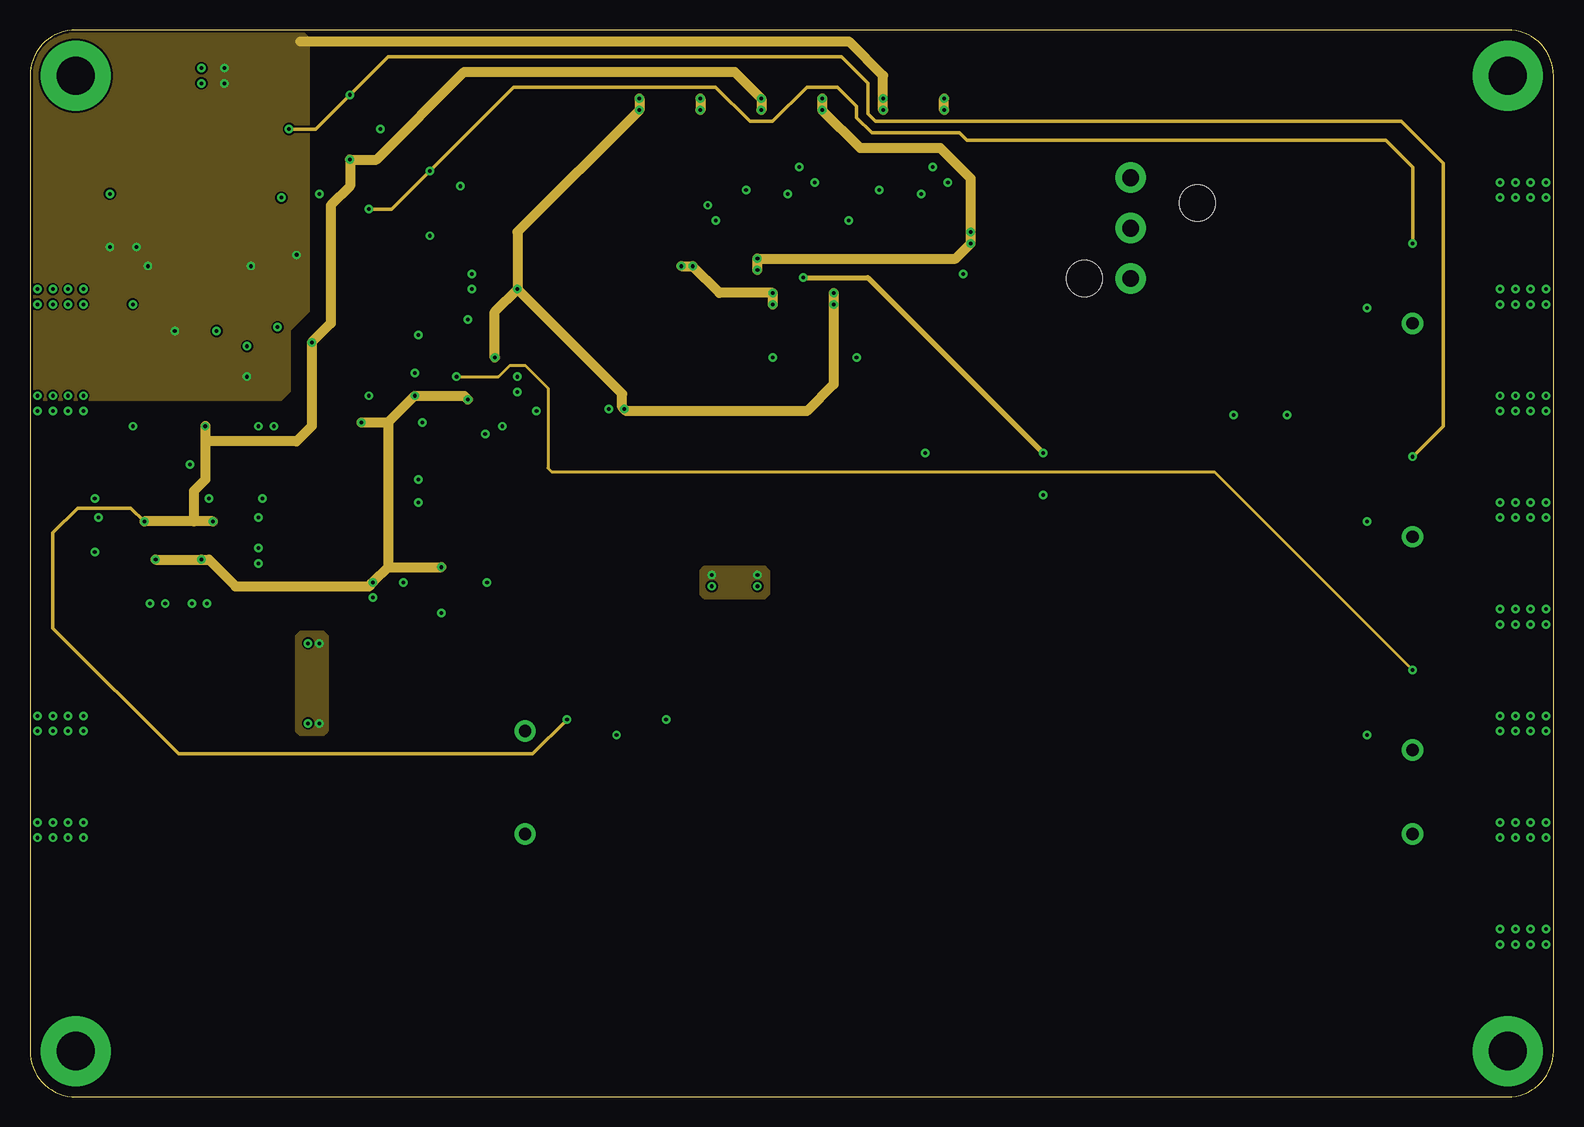
[diagram p8: board, inner layer Route15]
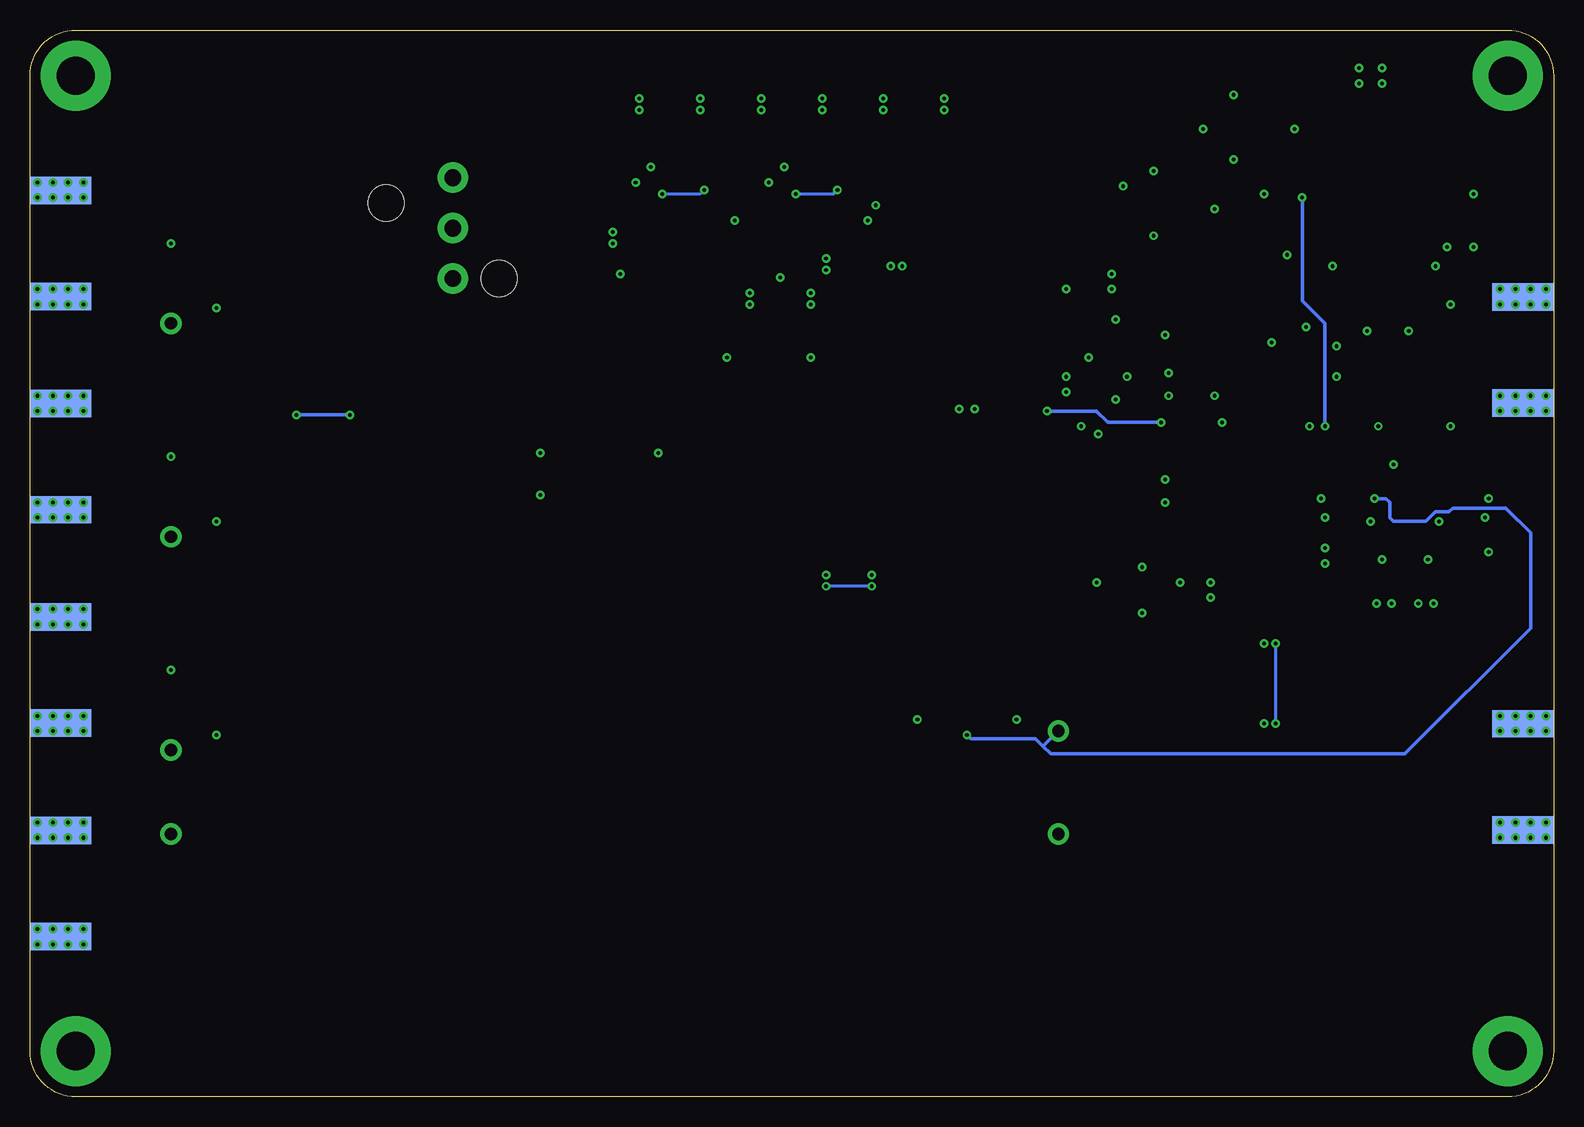
[diagram p9: board, bottom side, seen from below]

Size 127 x 88.9 mm. Coordinates in mm from the lower left corner, seen from the top.
Outline: 0,85.09 0,3.81 arc90 3.81,0 123.19,0 arc90 127,3.81 127,85.09 arc90 123.19,88.9 3.81,88.9 arc90 0,85.09
Copper layers (1+2*15+16): Top 0.035mm / dielectric 1.5mm / Route2 0.035mm / dielectric 0.15mm / Route15 0.035mm / dielectric 0.2mm / Bottom 0.035mm
Design rules: minimum track width 10mil, minimum drill 0.3mm, track to track 6mil, track to pad 6mil, pad to pad 6mil, via to via 6mil, smd to smd 6mil, copper to edge 8mil, drill to drill 8mil, minimum pad ring 10mil, minimum via ring 8mil, stop-mask expansion 4mil, vias tented up to drill 0mil, thermal gap 10mil

### Footprints (pad centres in the part's own frame; a part is rotated, then mirrored left to right if it is on the bottom)
C0603 = smd 1.1 x 1: 1 -0.85,0; 2 0.85,0
C0402 = smd 0.7 x 0.9: 1 -0.65,0; 2 0.65,0
CT7343 = smd 2.6 x 2.4: + -3.2,0; - 3.2,0
C1206 = smd 1.6 x 1.8: 1 -1.4,0; 2 1.4,0
SOD123 = smd 1.4 x 1.4: A 1.9,0; C -1.9,0
3,2-PAD = drill 3.2 pad 5.842: B3,2 0,0
QFN50P300X300X80-16N = smd 0.813 x 0.305: 1 -1.448,0.762; 2 -1.448,0.254; 3 -1.448,-0.254; 4 -1.448,-0.762; 9 1.448,-0.762; 10 1.448,-0.254; 11 1.448,0.254; 12 1.448,0.762 | smd 0.305 x 0.813: 5 -0.762,-1.448; 6 -0.254,-1.448; 7 0.254,-1.448; 8 0.762,-1.448; 13 0.762,1.448; 14 0.254,1.448; 15 -0.254,1.448; 16 -0.762,1.448 | smd 1.6 x 1.6: 17 0,0
SOT23-5 = smd 0.6 x 1.2: 1 -0.95,-1.306; 2 0,-1.306; 3 0.95,-1.306; 4 0.95,1.306; 5 -0.95,1.306
US8_3.1MM_JDEC_MO-187 = smd 0.3 x 0.7: 1 -0.75,-1.35; 2 -0.25,-1.35; 3 0.25,-1.35; 4 0.75,-1.35; 5 0.75,1.35; 6 0.25,1.35; 7 -0.25,1.35; 8 -0.75,1.35
SC70-6L = smd 0.35 x 0.8: 1 -0.65,-0.85; 2 0,-0.85; 3 0.65,-0.85; 4 0.65,0.85; 5 0,0.85; 6 -0.65,0.85
MSOP8 = smd 0.45 x 1: 1 -0.975,-2.05; 2 -0.325,-2.05; 3 0.325,-2.05; 4 0.975,-2.05; 5 0.975,2.05; 6 0.325,2.05; 7 -0.325,2.05; 8 -0.975,2.05
DFN14-4X3DE = smd 0.25 x 0.7: 1 -1.5,-1.4; 2 -1,-1.4; 3 -0.5,-1.4; 5 0.5,-1.4; 6 1,-1.4; 7 1.5,-1.4; 8 1.5,1.4; 10 0.5,1.4; 11 0,1.4; 12 -0.5,1.4; 13 -1,1.4; 14 -1.5,1.4 | smd 0.25 x 2: 4 0,-0.75; 9 1,0.75 | smd 1.75 x 1.65: 4@1 -0.75,0 | smd 1.07 x 1.65: 9@2 1,0
CONN_MOLEX_3PIN_MINI-FIT_JR = drill 1.4 pad 2.54: 1 4.2,0; 2 0,0; 3 -4.2,0 | hole 3: 2.1,-5.55; -4.2,3.85
CHIP-LED0805 = smd 1.2 x 1.2: A 0,-1.05; C 0,1.05
SOT23R_INFINEON = smd 0.8 x 0.9: 1 -0.95,-1; 2 0.95,-1; 3 0,1
SOT23-BEC = smd 1 x 1.4: B -0.95,-1.1; C 0,1.1; E 0.95,-1.1
R0603 = smd 1 x 1.1: 1 -0.85,0; 2 0.85,0
R0402 = smd 0.7 x 0.9: 1 -0.65,0; 2 0.65,0
R0805 = smd 1.3 x 1.5: 1 -0.85,0; 2 0.85,0
3269W = smd 1.194 x 2.794: 1 -2.54,-2.413; 2 0,2.413; 3 2.54,-2.413
CJS-1200TB = smd 1 x 1.3: 1 -1.75,-1.95; 2 0,1.95; 3 1.75,-1.95
TP08R = smd 0.8 x 0.8: TP 0,0
KEYSTONE_5000_MINIATURE = drill 1.016 pad 1.778: P$1 0,0
TP20R = smd 2 x 2: TP 0,0
SOP65P490X110-8N = smd 1.422 x 0.432: 1 -2.184,0.965; 2 -2.184,0.33; 3 -2.184,-0.33; 4 -2.184,-0.965; 5 2.184,-0.965; 6 2.184,-0.33; 7 2.184,0.33; 8 2.184,0.965
SOT95P280X110-5N = smd 1.321 x 0.559: 1 -1.295,0.94; 2 -1.295,0; 3 -1.295,-0.94; 4 1.295,-0.94; 5 1.295,0.94
J502-ND-142-0711-871/876 = smd 5.08 x 1.905: 1 2.565,0 | smd 5.08 x 2.286: G@1 2.565,4.42; G@2 2.565,-4.42 | smd 5.08 x 2.286 bottom: G@3 2.565,4.42; G@4 2.565,-4.42

### Placement (x,y rotation side)
C1  6.67,73.03 90 top
C2  7.62,48.26 180 top
C3  8.57,68.26 270 top
C4  10,42.86 270 top
C5  10.79,62.23 270 top
C6  13.34,62.23 270 top
C7  14.61,53.66 270 top
C8  14.76,42.86 270 top
C9  15.24,85.09 180 top
C10  17.14,49.85 0 top
C11  17.14,48.26 0 top
C12  17.14,45.72 0 top
C13  17.14,44.45 0 top
C14  19.68,61.28 90 top
C15  22.86,64.14 180 top
C16  26.04,42.23 270 top
C17  26.67,80.01 90 top
C18  27.3,82.23 0 top
C19  27.3,42.23 270 top
C20  27.94,80.01 90 top
C21  30.16,59.69 180 top
C22  30.16,58.42 180 top
C23  30.16,51.44 0 top
C24  33.02,42.23 270 top
C25  33.34,73.66 270 top
C26  33.97,75.88 0 top
C27  34.29,42.23 270 top
C28  34.61,73.66 270 top
C29  34.92,55.56 270 top
C30  38.73,68.58 180 top
C31  38.73,67.31 180 top
C32  38.73,60.01 0 top
C33  38.73,58.74 0 top
C34  48.9,60.01 180 top
C35  48.9,58.74 180 top
C36  54.93,73.03 90 top
C37  58.1,69.53 180 top
C38  60.96,77.47 0 top
C39  61.91,63.82 270 top
C40  63.18,73.03 270 top
C41  65.41,73.03 90 top
C42  68.9,63.82 270 top
C43  69.85,69.53 180 top
C44  72.07,77.47 0 top
C45  74.3,73.03 270 top
C46  74.61,68.58 0 top
C47  76.52,73.03 90 top
D1  37.47,48.58 0 top
H1  3.81,85.09 0 top
H2  3.81,3.81 0 top
H3  123.19,85.09 0 top
H4  123.19,3.81 0 top
IC1  12.38,46.99 270 top
IC2  23.81,80.01 180 top
IC3  30.16,56.2 270 top
IC4  30.48,73.66 180 top
IC5  38.73,64.77 270 top
IC6  38.73,56.2 270 top
IC7  48.9,56.2 270 top
IC8  59.69,73.03 0 top
IC9  70.8,73.03 0 top
J1  91.76,72.39 90 top
LED1  81.92,53.66 270 top
LED2  81.92,50.16 270 top
M1  30.16,48.58 90 top
Q1  11.75,72.71 180 top
Q2  11.75,58.1 180 top
Q3  11.75,53.66 180 top
Q4  15.56,72.71 180 top
Q5  15.56,66.36 180 top
Q6  19.37,72.71 0 top
R1  7.62,49.85 0 top
R2  7.62,45.4 180 top
R3  8.57,63.82 90 top
R4  8.57,60.64 90 top
R5  8.57,53.66 270 top
R6  8.89,73.03 270 top
R7  11.27,42.86 270 top
R8  13.49,42.86 270 top
R9  13.65,69.53 180 top
R10  15.24,58.42 0 top
R11  15.88,77.15 270 top
R12  18.41,66.99 90 top
R13  18.41,64.14 0 top
R14  20.32,53.66 270 top
R15  20.64,45.09 90 top
R16  22.23,72.39 270 top
R17  23.5,76.52 180 top
R18  30.16,70.17 180 top
R19  30.16,67.94 180 top
R20  30.16,65.72 0 top
R21  30.16,63.5 0 top
R22  30.16,61.28 180 top
R23  30.16,53.66 0 top
R24  30.16,37.78 180 top
R25  35.56,53.02 180 top
R26  38.73,53.02 180 top
R27  38.73,50.8 180 top
R28  43.81,64.77 180 top
R29  44.45,52.07 90 top
R30  46.67,52.07 90 top
R31  46.99,31.43 180 top
R32  48.9,52.07 90 top
R33  50.8,31.43 180 top
R34  51.12,52.07 90 top
R35  53.34,52.07 90 top
R36  77.15,53.66 180 top
R37  77.15,50.16 180 top
R38  105.41,65.72 0 top
R39  105.41,47.94 0 top
R40  105.41,30.16 0 top
R41  109.22,65.72 0 top
R42  109.22,47.94 0 top
R43  109.22,30.16 0 top
RT1  48.9,36.83 0 top
RT2  107.31,71.12 0 top
RT3  107.31,53.34 0 top
RT4  107.31,35.56 0 top
SW1  115.25,71.12 90 top
SW2  115.25,53.34 90 top
SW3  115.25,35.56 90 top
T1  11.75,66.36 180 top
T2  16.51,61.28 270 top
T3  17.46,53.66 0 top
T4  19.37,77.15 90 top
T5  21.59,66.99 90 top
T6  26.04,70.8 90 top
T7  26.04,66.99 90 top
TP1  27.94,54.61 0 top
TP2  41.27,30.48 0 top
TP3  41.27,21.91 0 top
TP4  50.8,85.09 0 top
TP5  55.88,85.09 0 top
TP6  60.96,85.09 0 top
TP7  66.04,85.09 0 top
TP8  71.12,85.09 0 top
TP9  76.2,85.09 0 top
TP10  115.25,64.45 0 top
TP11  115.25,46.67 0 top
TP12  115.25,28.89 0 top
TP13  115.25,21.91 0 top
U1  30.16,42.23 90 top
U2  37.15,42.23 90 top
U3  65.41,63.82 0 top
X1  0,62.23 0 top
X2  0,26.67 0 top
X3  127,71.12 180 top
X4  127,53.34 180 top
X5  127,35.56 180 top
X6  127,17.78 180 top

### Tracks (layer width: path | path; a pad name or v marks a point on that pad's centre or on a via)
!FORCE_QUENCH  (via drill 0.3)
  Top 0.254: IC3.7 32,56.45 32.7,57.15 32.7,59.69 v32.07,60.33 31.11,61.28 | v23.18,37.78 23.18,43.5 25.72,46.04 25.72,57.47 27.3,59.05 27.3,61.59 27.94,62.23 30.06,62.23 R22.1 | v23.18,31.11 23.18,30.8 23.81,30.16 33.97,30.16 46.35,42.55 v56.83,42.55 | X6.1 104.14,17.78 79.38,42.55 v60.64,42.55
  Top 0.305: R22.1 31.11,61.28
  Bottom 0.254: v23.18,37.78 v23.18,31.11 | v56.83,42.55 v60.64,42.55
!ONE_SHOT_CLR  (via drill 0.3)
  Top 0.305: IC6.8 42.2,57.17 v42.23,57.15 | IC3.6 32.45,55.95 v32.7,56.2
  Bottom 0.305: v42.23,57.15 38.1,57.15 37.15,56.2 v32.7,56.2
BLANKING_LATCH_EN
  Top 0.305: R35.1 R34.1 R32.1 R30.1 R29.1 44.45,46.99 43.81,46.35 37.47,46.35 36.82,45.71 U2.7
COMP_LE_N
  Top 0.254: IC1.6 4.66,47.24 3.56,46.14 3.56,39.9 10.37,33.08 32.81,33.08 36.13,36.41 36.13,39.99 U2.1
COMP_LE_P
  Top 0.254: IC1.7 4.87,46.74 4.06,45.93 4.06,40.11 10.58,33.59 32.6,33.59 35.62,36.62 35.62,41.02 35.88,41.27 36.51,41.27 36.82,40.97 U2.2
COMP_Q_N
  Top 0.254: IC1.10 12.13,43.5 | 12.13,43.5 12.13,39.9 16.72,35.31 29.32,35.31 30.42,36.41 30.42,37.78 | 30.42,37.78 30.42,39.97 U1.3 | R24.1 30.42,37.78 | R7.1 12.11,43.51 12.13,43.5
COMP_Q_P
  Top 0.254: IC1.11 12.64,43.5 | 12.64,43.5 12.64,40.11 16.93,35.81 29.11,35.81 29.91,36.62 29.91,37.78 | 29.91,37.78 29.91,39.97 U1.2 | R24.2 29.91,37.78 | R8.1 12.65,43.51 12.64,43.5
GND  (via drill 0.3)
  Top 0.254: IC9.5 70.8,71.62 IC9.4 70.05,73.03 | IC8.5 59.69,71.62 IC8.4 58.94,73.03
  Top 0.305: v8.57,55.88 R5.1 | v15.56,63.82 Q5.C Q4.C | RT4.3 110.07,32.93 R43.2 v111.44,30.16 | RT3.3 110.07,50.71 R42.2 v111.44,47.94 | RT2.3 110.07,68.49 R41.2 v111.44,65.72 | v3.17,58.42 X1.G@4 1.96,58.42 v1.91,58.42 | X1.G@1 v3.17,66.04 | RT1.3 51.65,34.2 R33.1 v53.02,31.43 | v20.64,64.14 C15.2 | R14.1 v20.32,55.88 | U3.4 66.34,62.88 | 68.81,62.88 C42.2 | R2.2 v5.4,45.4 | C8.2 v14.76,41.12 | C4.2 v10,41.12 | R7.2 v11.27,41.12 | R8.2 v13.49,41.12 | R1.1 v5.4,49.85 | C28.2 C25.2 | v33.34,71.75 C25.2 | IC5.2 v36.51,64.77 | v13.34,52.7 14.5,52.7 C7.2 | R21.2 v32.38,63.5 | C25.2 31.73,73.01 31.43,72.7 IC4.5 | C21.2 C22.2 | v32.38,49.53 M1.2 31.01,49.68 C23.2 | C22.2 29.53,58.42 | IC3.4 29.41,55.45 29.51,55.55 C22.2 | v28.26,58.42 C22.2 | C29.2 35.23,55.22 IC6.4 37.92,55.22 v37.94,55.24 | 39.38,55.9 v39.37,55.88 v39.38,55.87 | C10.2 v19.37,49.85 | C2.2 v5.71,48.26 | v19.05,48.26 C11.2 17.8,47.96 17.08,47.24 IC1.15 | C12.2 v19.05,45.72 | C13.2 v19.05,44.45 | 31.13,42.88 v31.11,42.86 | 27.32,41.59 C19.2 | 38.11,42.88 v38.1,42.86 | 34.3,41.59 C27.2 | 48.26,58.72 C35.2 | v32.38,51.44 30.8,51.44 | C3.2 v8.57,66.04 | C1.2 v6.67,75.25 | 29.2,80.66 v29.21,80.64 | 27.95,80.67 C20.2 | C26.2 v35.88,75.88 | v24.13,75.25 24.13,76.3 R17.1 | v18.1,62.55 19.27,62.55 C14.2
  Top 0.406: U3.4 68.81,62.88 | C31.2 v36.83,67.31 | C30.2 v36.83,68.58 | X3.G@4 v125.09,76.2 | X3.G@1 124.48,66.7 v125.09,67.31 | X4.G@4 v125.09,58.42 | X4.G@1 124.48,48.92 v125.09,49.53 | X5.G@4 v125.09,40.64 | X5.G@1 124.48,31.14 v125.09,31.75 | X6.G@4 v125.09,22.86 | X6.G@1 124.48,13.36 v125.09,13.97 | X2.G@4 v3.17,22.86 | X2.G@1 2.56,31.14 v3.17,31.75 | IC2.2 23.81,80.64 24.13,80.33 26.34,80.33 C17.2 C20.2 29.2,80.66 | U2.6 U2.5 38.11,42.88 | C24.2 C27.2 35.23,41.58 36.51,42.86 v38.1,42.86 | C19.2 C16.2 | C32.2 C33.2 39.38,55.9 | IC6.5 IC6.6 v39.38,55.87 | C34.2 C35.2 | IC7.4 47.6,55.22 48.26,55.88 v48.26,57.31 48.26,58.72 | v31.11,42.86 29.84,41.59 v28.57,41.59 27.32,41.59 | U1.5 31.13,42.88 | v34.29,40.32 34.29,41.59 | C18.2 27.95,80.67 | U3.2 62.76,63.82 C39.2 v61.91,61.59 | v68.9,61.59 C42.2 | v40.64,60.01 C32.2 | v40.64,58.74 C33.2 | R36.2 v74.61,53.66 | LED2.C v84.45,50.16
  Top 0.813: C44.2 v75.25,77.47 | C46.2 v77.79,68.58 | C47.2 v76.52,76.2 | C38.2 v64.14,77.47 | C41.2 v65.41,76.2 | v68.26,73.03 70.05,73.03 | v57.15,73.03 58.94,73.03 | TP9.TP v76.2,82.23 | v56.52,74.3 55.06,74.3 C36.2
  Route15 0.813: v76.2,82.23 v76.2,83.19
  Bottom 0.406: X2.G@1 v1.91,31.75 | X2.G@4 2.52,22.25 v1.91,22.86 | X1.G@4 2.52,57.81 v1.91,58.42 | X1.G@1 v1.91,67.31 | X3.G@4 124.44,75.59 v123.83,76.2 | X3.G@1 v123.83,67.31 | X4.G@4 124.44,57.81 v123.83,58.42 | X4.G@1 v123.83,49.53 | X5.G@4 124.44,40.03 v123.83,40.64 | X5.G@1 v123.83,31.75 | X6.G@4 124.44,22.25 v123.83,22.86 | X6.G@1 v123.83,13.97
  other vias: 0.64,58.42 4.45,58.42 4.45,57.15 3.17,57.15 1.91,57.15 0.64,57.15 0.64,66.04 1.91,66.04 4.45,66.04 4.45,67.31 3.17,67.31 0.64,67.31 122.56,76.2 126.36,76.2 126.36,74.93 125.09,74.93 123.83,74.93 122.56,74.93 122.56,67.31 126.36,67.31 126.36,66.04 125.09,66.04 123.83,66.04 122.56,66.04 126.36,58.42 122.56,58.42 122.56,57.15 123.83,57.15 125.09,57.15 126.36,57.15 126.36,49.53 122.56,49.53 122.56,48.26 123.83,48.26 125.09,48.26 126.36,48.26 126.36,40.64 122.56,40.64 122.56,39.37 123.83,39.37 125.09,39.37 126.36,39.37 126.36,31.75 122.56,31.75 122.56,30.48 123.83,30.48 125.09,30.48 126.36,30.48 126.36,22.86 122.56,22.86 122.56,21.59 123.83,21.59 125.09,21.59 126.36,21.59 126.36,13.97 122.56,13.97 122.56,12.7 123.83,12.7 125.09,12.7 126.36,12.7 0.64,31.75 4.45,31.75 4.45,30.48 3.17,30.48 1.91,30.48 0.64,30.48 0.64,22.86 4.45,22.86 4.45,21.59 3.17,21.59 1.91,21.59 0.64,21.59 14.29,84.45 14.29,85.72 24.13,31.11 24.13,37.78 56.83,43.5 60.64,43.5
  pour Route2: 0,0 152.4,0 152.4,101.6 0,101.6
  pour Top (no thermals): 10.79,86.36 14.29,86.36 14.61,86.04 14.61,84.14 14.29,83.82 10.79,83.82
  pour Route15: 22.54,30.16 22.23,30.48 22.23,38.42 22.54,38.73 24.45,38.73 24.77,38.42 24.77,30.48 24.45,30.16
  pour Route15: 55.88,43.81 55.88,41.91 56.2,41.59 61.28,41.59 61.59,41.91 61.59,43.81 61.28,44.13 56.2,44.13
HOLDOFF_TRIG
  Top 0.305: IC3.1 27.1,56.95 26.67,56.52 26.67,48.58 29.83,45.41 U1.7
LOGIC_QUENCH
  Top 0.305: 35.56,64.77 36.35,63.98 37.74,63.98 IC5.3 | 35.56,64.77 36.35,65.56 37.74,65.56 IC5.1 | R23.2 31.01,54.95 IC3.5 33.22,55.45 33.66,55.88 33.66,64.77 | 33.66,64.77 32.7,65.72 R20.2 | 35.56,64.77 33.66,64.77
LOGIC_QUENCH_ATTEN
  Top 0.305: T7.B 28.99,66.04 R20.1 R21.1
N$2
  Top 0.254: X2.1 54.61,26.67 58.74,30.8 58.74,60.64 54.61,64.77 R28.1
N$3
  Top 0.305: IC1.4 11.62,48.7 10.48,49.85 R1.2
N$4
  Top 0.305: IC1.14 19.84,46.74 R15.2
N$5
  Top 0.305: C5.1 10.79,64.67 | 10.79,64.67 T1.E | R3.2 10.79,64.67
N$6
  Top 0.305: R2.1 9.53,45.4 10.35,46.23 IC1.8
N$8
  Top 0.254: IC8.3 59.19,69.61 C37.1
N$9  (via drill 0.3)
  Top 0.254: C40.1 v63.18,75.25 | IC8.11 v59.69,75.56
  Bottom 0.254: v63.18,75.25 60.01,75.25 v59.69,75.56
N$10
  Top 0.305: Q3.E 10.8,55.88 11.75,56.83 Q2.C
N$11
  Top 0.305: R9.1 14.5,67.56 Q5.E
N$12
  Top 0.305: C6.1 13.34,66.67 12.7,67.31 T1.B 12.8,67.56 R9.2 12.8,70.38 11.75,71.44 Q1.C
N$13
  Top 0.305: T2.E 15.41,59.1 R10.2
N$14
  Top 0.305: C5.2 10.79,59.69 | 10.79,59.69 Q2.E | R4.1 10.69,59.79 10.79,59.69
N$15
  Top 0.305: T5.E 23.82,67.94 24.77,66.99 T7.C
N$16  (via drill 0.3)
  Top 0.305: IC2.1 24.77,82.23 24.45,82.55 21.91,82.55 19.37,80.01 19.37,77.15 20.32,76.2 T4.B 20.64,76.2 20.95,75.88 v20.95,74.93 | T3.B 16.51,52.71 17.46,53.66 18.41,53.66 19.05,54.29 v19.05,55.88
  Bottom 0.305: v20.95,74.93 20.95,66.36 19.05,64.45 v19.05,55.88
N$18
  Top 0.305: Q6.C Q4.B 16.51,75.67 R11.2
N$19
  Top 0.305: C6.2 13.34,60.01 12.7,59.37 Q2.B 12.7,59.06 13.34,58.42 R10.1 14.39,57.37 14.92,56.83 16.83,56.83 17.46,56.2 T3.C
N$20
  Top 0.305: R14.2 18.66,52.81 T3.E
N$21
  Top 0.305: T2.B 15.55,62.23 17.46,64.14 R13.1 17.57,64.35 17.14,64.77 17.14,66.67 16.51,67.31 Q5.B
N$22
  Top 0.305: T5.C 20.32,66.99 19.47,66.14 R12.1 18.73,65.83 18.73,64.77 19.27,64.24 R13.2
N$23
  Top 0.305: IC2.4 22.86,78.11 | 22.86,78.11 22.86,76.73 R17.2 | T4.E 22.86,78.1 22.86,78.11
N$24
  Top 0.305: T6.C 24.93,70 26.99,67.94 T7.E R19.2
N$25
  Top 0.305: R25.1 R26.2 38.73,53.87 38.73,55.56 37.77,56.52 IC6.2
N$26
  Top 0.305: R6.1 10.73,73.88 Q1.E
N$27
  Top 0.305: T4.C 16.73,77.15 R11.1
N$29
  Top 0.305: Q6.E 20.32,72.7 20.64,73.03 22.01,73.03 R16.1
N$30
  Top 0.305: T6.B 26.98,69.85 26.04,70.8 26.04,73.66 28.57,76.2 31.11,76.2 31.43,75.88 IC4.1
N$31
  Top 0.305: Q6.B 18.42,71.75 17.46,72.71 15.56,72.71 14.61,73.66 Q4.E Q1.B
N$33
  Top 0.254: IC9.3 70.3,69.93 C43.1
N$34  (via drill 0.3)
  Top 0.254: IC9.11 v70.8,75.56 | C45.1 v74.3,75.25
  Bottom 0.254: v74.3,75.25 71.12,75.25 v70.8,75.56
N$35
  Top 0.305: T6.E 29.53,71.75 | IC4.4 29.53,71.75 | 29.53,71.75 29.53,70.39 R18.2
N$36
  Top 0.305: R27.2 37.78,50.8 D1.C 34.62,47.63 M1.1
N$37
  Top 0.305: IC5.6 40.31,65.42 40.96,64.77 | IC5.4 40.31,64.12 40.96,64.77 | 40.96,64.77 R28.2 42.97,60.22 46.02,57.17 IC7.1
N$39
  Top 0.406: LED1.A R36.1
N$40
  Top 0.406: LED2.A R37.1
NC_!LOGIC_QUENCH
  Top 0.305: IC3.3 28.32,55.95 27.94,55.56 TP1.TP
ONE_SHOT_CAP
  Top 0.305: R23.1 29.31,52.55 | 29.31,52.55 C23.1 29.31,48.73 M1.3 | R25.2 34.61,53.02 34.13,52.55 29.31,52.55
ONE_SHOT_CLR
  Top 0.305: D1.A 39.59,48.8 R27.1 R26.1 40.64,53.02 41.91,54.29 41.91,56.2 41.59,56.52 IC6.7
PP_N5V0  (via drill 0.3)
  Top 0.305: C28.1 C25.1 33.23,74.51 32.7,73.98 30.48,73.98 | IC4.2 30.48,73.98 | 30.48,73.98 30.48,70.7 R18.1 R19.1 31.01,67.84 30.16,66.99 26.35,66.99 26.04,66.67 26.04,59.69 24.77,58.42 24.77,46.67 22.33,44.23 R15.1 19.9,43.5 16.83,43.5 16.5,43.83 C13.1 C12.1 15.99,46.23 IC1.13 | RT2.1 104.56,68.49 R38.1 103.61,64.77 70.8,64.77 67.31,68.26 v64.45,68.26
  Top 0.406: v55.88,82.23 51.75,78.11 51.75,73.66 | 51.75,73.66 51.75,68.26 53.02,66.99 60.33,66.99 61.59,68.26 61.59,70.48 | C28.1 51.1,74.31 51.75,73.66 | v64.45,68.26 64.45,70.17 | LED1.C v84.45,53.66
  Top 0.813: TP5.TP v55.88,82.23
  Route15 0.406: v64.45,68.26 69.85,68.26 v84.45,53.66
  Route15 0.813: v55.88,83.19 v55.88,82.23
  pour Top: 60.96,70.48 60.96,73.03 66.36,73.03 66.67,72.71 66.67,70.48 66.36,70.17 61.28,70.17
PP_N15V0  (via drill 0.3)
  Top 0.254: IC8.9 IC8.6 60.69,70.22 v60.64,69.85
  Top 0.813: TP7.TP v66.04,82.23 | v60.64,69.85 v60.64,68.9
  Route15 0.813: v66.04,83.19 v66.04,82.23 69.22,79.06 75.88,79.06 78.42,76.52 v78.42,72.07 v78.42,71.12 77.15,69.85 v60.64,69.85 v60.64,68.9
  pour Top (rank 4): 72.07,73.03 72.07,71.12 72.71,70.48 74.61,70.48 74.93,70.17 77.79,70.17 78.11,70.48 78.42,70.48 78.74,70.8 78.74,72.71 78.42,73.03
PP_NVIN
  Top 0.254: IC9.9 IC9.6 71.8,68.63 71.75,68.58 C46.1
  pour Top: 71.12,66.04 71.12,71.12 71.75,71.12 71.75,70.8 72.39,70.17 74.61,70.17 74.93,69.85 77.79,69.85 78.11,70.17 93.34,70.17 93.66,69.85 93.66,66.04 93.34,65.72 71.44,65.72
PP_P3V3  (via drill 0.3)
  Top 0.305: RT4.1 104.56,32.93 R40.1 103.19,30.16 102.55,30.8 102.55,61.28 100.65,63.18 70.48,63.18 69,64.67 C42.1 68.81,64.76 | IC5.5 39.05,64.77 38.73,65.09 38.73,65.72 39.37,66.36 39.37,67.3 C31.1 | C22.1 C21.1 30.8,59.69 29.31,61.17 R22.2 | C22.1 30.81,57.13 31,56.95 IC3.8 | IC3.2 27.87,56.45 v27.62,56.2 | C22.1 v32.07,58.42 | IC1.12 13.14,45.28 13.65,44.77 v14.29,44.77 14.76,44.29 C8.1 | C4.1 10.16,44.45 v10.48,44.77 11.11,44.77 11.62,45.28 IC1.9 | 36.51,57.34 IC6.1 | 66.99,64.76 U3.5 | 28.56,42.88 v28.57,42.86
  Top 0.406: U3.5 68.81,64.76 | C30.1 C31.1 v40.64,67.31 | C24.1 C27.1 | U2.8 36.18,43.8 35.26,42.88 C27.1 | C16.1 C19.1 28.56,42.88 | IC6.1 37.49,57.17 38.09,57.77 C33.1 C32.1 38.09,60.95 v38.73,61.59 | C34.1 C35.1 49.55,57.32 v49.53,57.31 49.67,57.17 IC7.8 | v36.51,58.1 36.51,57.34 | v34.29,44.13 C27.1 | v66.99,66.99 v66.99,66.04 66.99,64.76 | U1.8 29.2,43.48 v28.57,42.86
  Top 0.813: TP4.TP v50.8,82.23
  Route15 0.813: v10.48,44.77 v14.29,44.77 14.92,44.77 17.14,42.55 28.26,42.55 v28.57,42.86 29.84,44.13 | 29.84,44.13 v34.29,44.13 | v36.51,58.1 36.2,58.42 v32.07,58.42 29.84,56.2 | v27.62,56.2 29.84,56.2 | v50.8,83.19 v50.8,82.23 40.64,72.07 v40.64,67.31 | v40.64,67.31 38.73,65.41 v38.73,61.59 | v66.99,66.99 66.99,59.37 64.77,57.15 49.69,57.15 v49.53,57.31 49.37,57.47 49.37,58.58 v40.64,67.31 | 29.84,56.2 29.84,44.13
PP_P5V0  (via drill 0.3)
  Top 0.305: R39.1 104.56,50.71 RT3.1 v104.78,56.83 | RT1.1 46.14,34.2 R31.2 v44.77,31.43 | Q3.B 14.36,54.76 C7.1 v14.61,55.88 | T5.B 22.86,66.04 23.71,65.19 C15.1 23.71,63.08 v23.5,62.87 | IC1.5 9.72,47.75 v9.53,47.94 9.21,48.26 C2.1 | IC1.16 15.05,47.75 v15.24,47.94 15.56,48.26 C11.1 | 62,64.76 C39.1 | U3.1 65.1,64.76 65.41,64.45 65.41,62.87 | 65.41,62.87 65.41,59.37 67.63,57.15 | 67.63,57.15 v100.33,56.83 | U3.3 65.39,62.88 65.41,62.87 | 67.63,57.15 67.63,51.75 69.22,50.16 R37.2
  Top 0.406: C20.1 C17.1 | C17.1 v26.67,78.11 | C17.1 25.07,79.36 24.76,79.06 IC2.5 | U3.1 62,64.76 | v60.96,82.23 59.69,80.96 56.83,80.96 53.34,77.47 53.34,73.03 53.66,72.71 | v61.91,66.99 v61.91,66.04 C39.1
  Top 0.813: TP6.TP v60.96,82.23
  Route15 0.305: v9.53,47.94 8.41,49.05 3.97,49.05 1.91,46.99 1.91,39.05 12.38,28.57 41.91,28.57 v44.77,31.43
  Route15 0.813: v15.24,47.94 13.65,47.94 | 13.65,47.94 v9.53,47.94 | v14.61,55.88 14.61,54.61 | 14.61,54.61 14.61,51.44 13.65,50.48 13.65,47.94 | 14.61,54.61 22.23,54.61 23.5,55.88 v23.5,62.87 25.08,64.45 25.08,74.3 26.67,75.88 v26.67,78.11 28.89,78.11 36.2,85.41 58.74,85.41 v60.96,83.19 v60.96,82.23 | v61.91,66.04 v61.91,66.99 57.47,66.99 v55.24,69.22 v54.29,69.22
  Bottom 0.305: v100.33,56.83 v104.78,56.83
  pour Top: 53.66,73.03 53.34,72.71 53.34,68.9 53.66,68.58 58.42,68.58 58.74,68.9 58.74,72.71 58.42,73.03
PP_P15V0  (via drill 0.3)
  Top 0.305: v12.06,63.82 12.06,64.94 T1.C | R6.2 v8.89,70.8 | R12.2 v18.41,69.22 | R16.2 v22.23,70.17 | C1.1 v6.67,70.8 6.99,70.8 8.57,69.22 | 11.75,65.41 11.75,68.58 11.11,69.22 v9.84,69.22 8.68,69.22 C3.1 | C14.1 18.46,60.43 | 18.46,60.43 T2.C | v18.1,60.01 18.1,60.06 18.46,60.43
  Top 0.813: v71.12,82.23 v71.12,83.19 TP8.TP
  Route15 0.813: 22.54,87.95 68.26,87.95 TP8.TP v71.12,82.23
  other vias: 16.19,85.72 16.19,84.45
  pour Route15: 0,88.9 22.54,88.9 23.18,88.27 23.18,65.41 21.59,63.82 21.59,58.74 20.95,58.1 0,58.1
  pour Top (no thermals): 15.88,86.04 15.88,84.14 16.19,83.82 19.68,83.82 19.68,86.36 16.19,86.36
  pour Top (rank 4): 58.1,73.98 62.55,73.98 67.94,68.58 69.53,68.58 69.85,68.9 69.85,71.75 67.94,73.66 67.94,78.42 71.44,81.92 71.44,83.5 70.8,83.5 66.36,79.06 58.42,79.06 58.1,78.74
PP_PVIN
  pour Top (rank 6): 68.58,73.98 71.44,73.98 72.07,74.61 93.34,74.61 93.66,74.93 93.66,78.74 93.34,79.06 69.53,79.06 68.58,78.11
SPAD_PULLDN_SENSE
  Top 0.305: R5.2 8.82,52.56 Q3.C 12.13,52.18 IC1.3
TAP1
  Top 0.305: IC7.7 51.74,56.52 53.34,54.93 R35.2
TAP2
  Top 0.305: R29.2 44.45,55.56 45.41,56.52 IC7.2
TAP3
  Top 0.305: R32.2 48.9,54.93 49.84,55.87 IC7.6
TAP4
  Top 0.305: IC7.3 46.03,55.87 45.72,55.56 45.72,53.87 R30.2
TAP5
  Top 0.305: IC7.5 50.95,53.09 R34.2
VREF_AV_DET  (via drill 0.3)
  Top 0.305: RT1.2 48.9,31.75 | 48.9,31.75 48.9,31.11 | 48.9,31.11 v48.9,30.16 | C10.1 v14.92,49.85 13.34,49.85 12.64,49.15 IC1.2 | R33.2 49.21,31.43 48.9,31.75 | R31.1 48.58,31.43 48.9,31.11
  Bottom 0.305: v14.92,49.85 13.97,49.85 13.65,49.53 13.65,48.26 13.34,47.94 10.64,47.94 9.84,48.74 8.73,48.74 8.41,49.05 3.97,49.05 1.91,46.99 1.91,39.05 12.38,28.57 41.91,28.57 42.55,29.21 | 42.55,29.21 43.18,29.84 48.58,29.84 v48.9,30.16 | TP2.P$1 42.55,29.21
VREF_CASCODE_IBIAS  (via drill 0.3)
  Top 0.305: C26.1 33.32,77.14 v33.34,77.15 | IC4.3 29.53,74.61 28.89,73.98 v28.26,73.98 | SW1.2 v115.25,71.12 TP10.P$1
  Route15 0.305: v28.26,73.98 30.16,73.98 v33.34,77.15 40.32,84.14 57.15,84.14 60.01,81.28 61.91,81.28 64.77,84.14 67.31,84.14 68.9,82.55 68.9,81.6 70.17,80.33 77.47,80.33 78.11,79.69 113.03,79.69 115.25,77.47 v115.25,71.12
VREF_CASCODE_IBIAS_EXT
  Top 0.305: X3.1 118.95,71.12 SW1.1
VREF_CASCODE_IBIAS_INT
  Top 0.305: R41.1 107.31,65.72 | 107.31,65.72 R38.2 | 107.31,65.72 RT2.2 116.54,73.53 SW1.3
VREF_DIAMOND_IBIAS  (via drill 0.3)
  Top 0.305: IC2.3 22.86,81.28 22.23,80.64 v21.59,80.64 | 26.66,83.49 v26.67,83.5 | SW2.2 v115.25,53.34 TP11.P$1
  Top 0.406: C18.1 26.66,83.49
  Route15 0.305: v21.59,80.64 23.81,80.64 v26.67,83.5 29.84,86.68 67.63,86.68 69.85,84.45 69.85,81.92 70.48,81.28 114.3,81.28 117.79,77.79 117.79,55.88 v115.25,53.34
VREF_DIAMOND_IBIAS_EXT
  Top 0.305: X4.1 118.95,53.34 SW2.1
VREF_DIAMOND_IBIAS_INT
  Top 0.305: R42.1 107.31,47.94 | 107.31,47.94 R39.2 | 107.31,47.94 RT3.2 116.54,55.75 SW2.3
VREF_ONE_SHOT  (via drill 0.3)
  Top 0.305: IC6.3 35.27,55.87 C29.1 34.94,56.21 35.56,56.83 v35.56,60.01 | SW3.2 v115.25,35.56 TP12.P$1
  Route15 0.254: v35.56,60.01 39.05,60.01 40.01,60.96 41.27,60.96 43.18,59.05 43.18,52.39 43.5,52.07 98.74,52.07 v115.25,35.56
VREF_ONE_SHOT_EXT
  Top 0.305: X5.1 118.95,35.56 SW3.1
VREF_ONE_SHOT_INT
  Top 0.305: R43.1 107.31,30.16 | 107.31,30.16 R40.2 | 107.31,30.16 RT4.2 116.54,37.97 SW3.3
VSPAD
  Top 0.305: R4.2 8.57,61.59 7.94,62.23 | R3.1 8.57,62.87 7.94,62.23 | X1.1 7.94,62.23

### Text on the board
tPlace: + | P3V3 | N5V0 | P5V0 | N15V0 | P15V0 | GND | VIN+ | GND | INT | EXT | VIN- | INT | -5V Ind. | EXT | TAP2 | TAP4 | TAP3 | TAP5 | TAP1 | +5V Ind. | Latch Delay Select | Comp. Trigger Level Adj. | INT | EXT